# EAGLE design Display70_Cape (EAGLE 7.7.0)
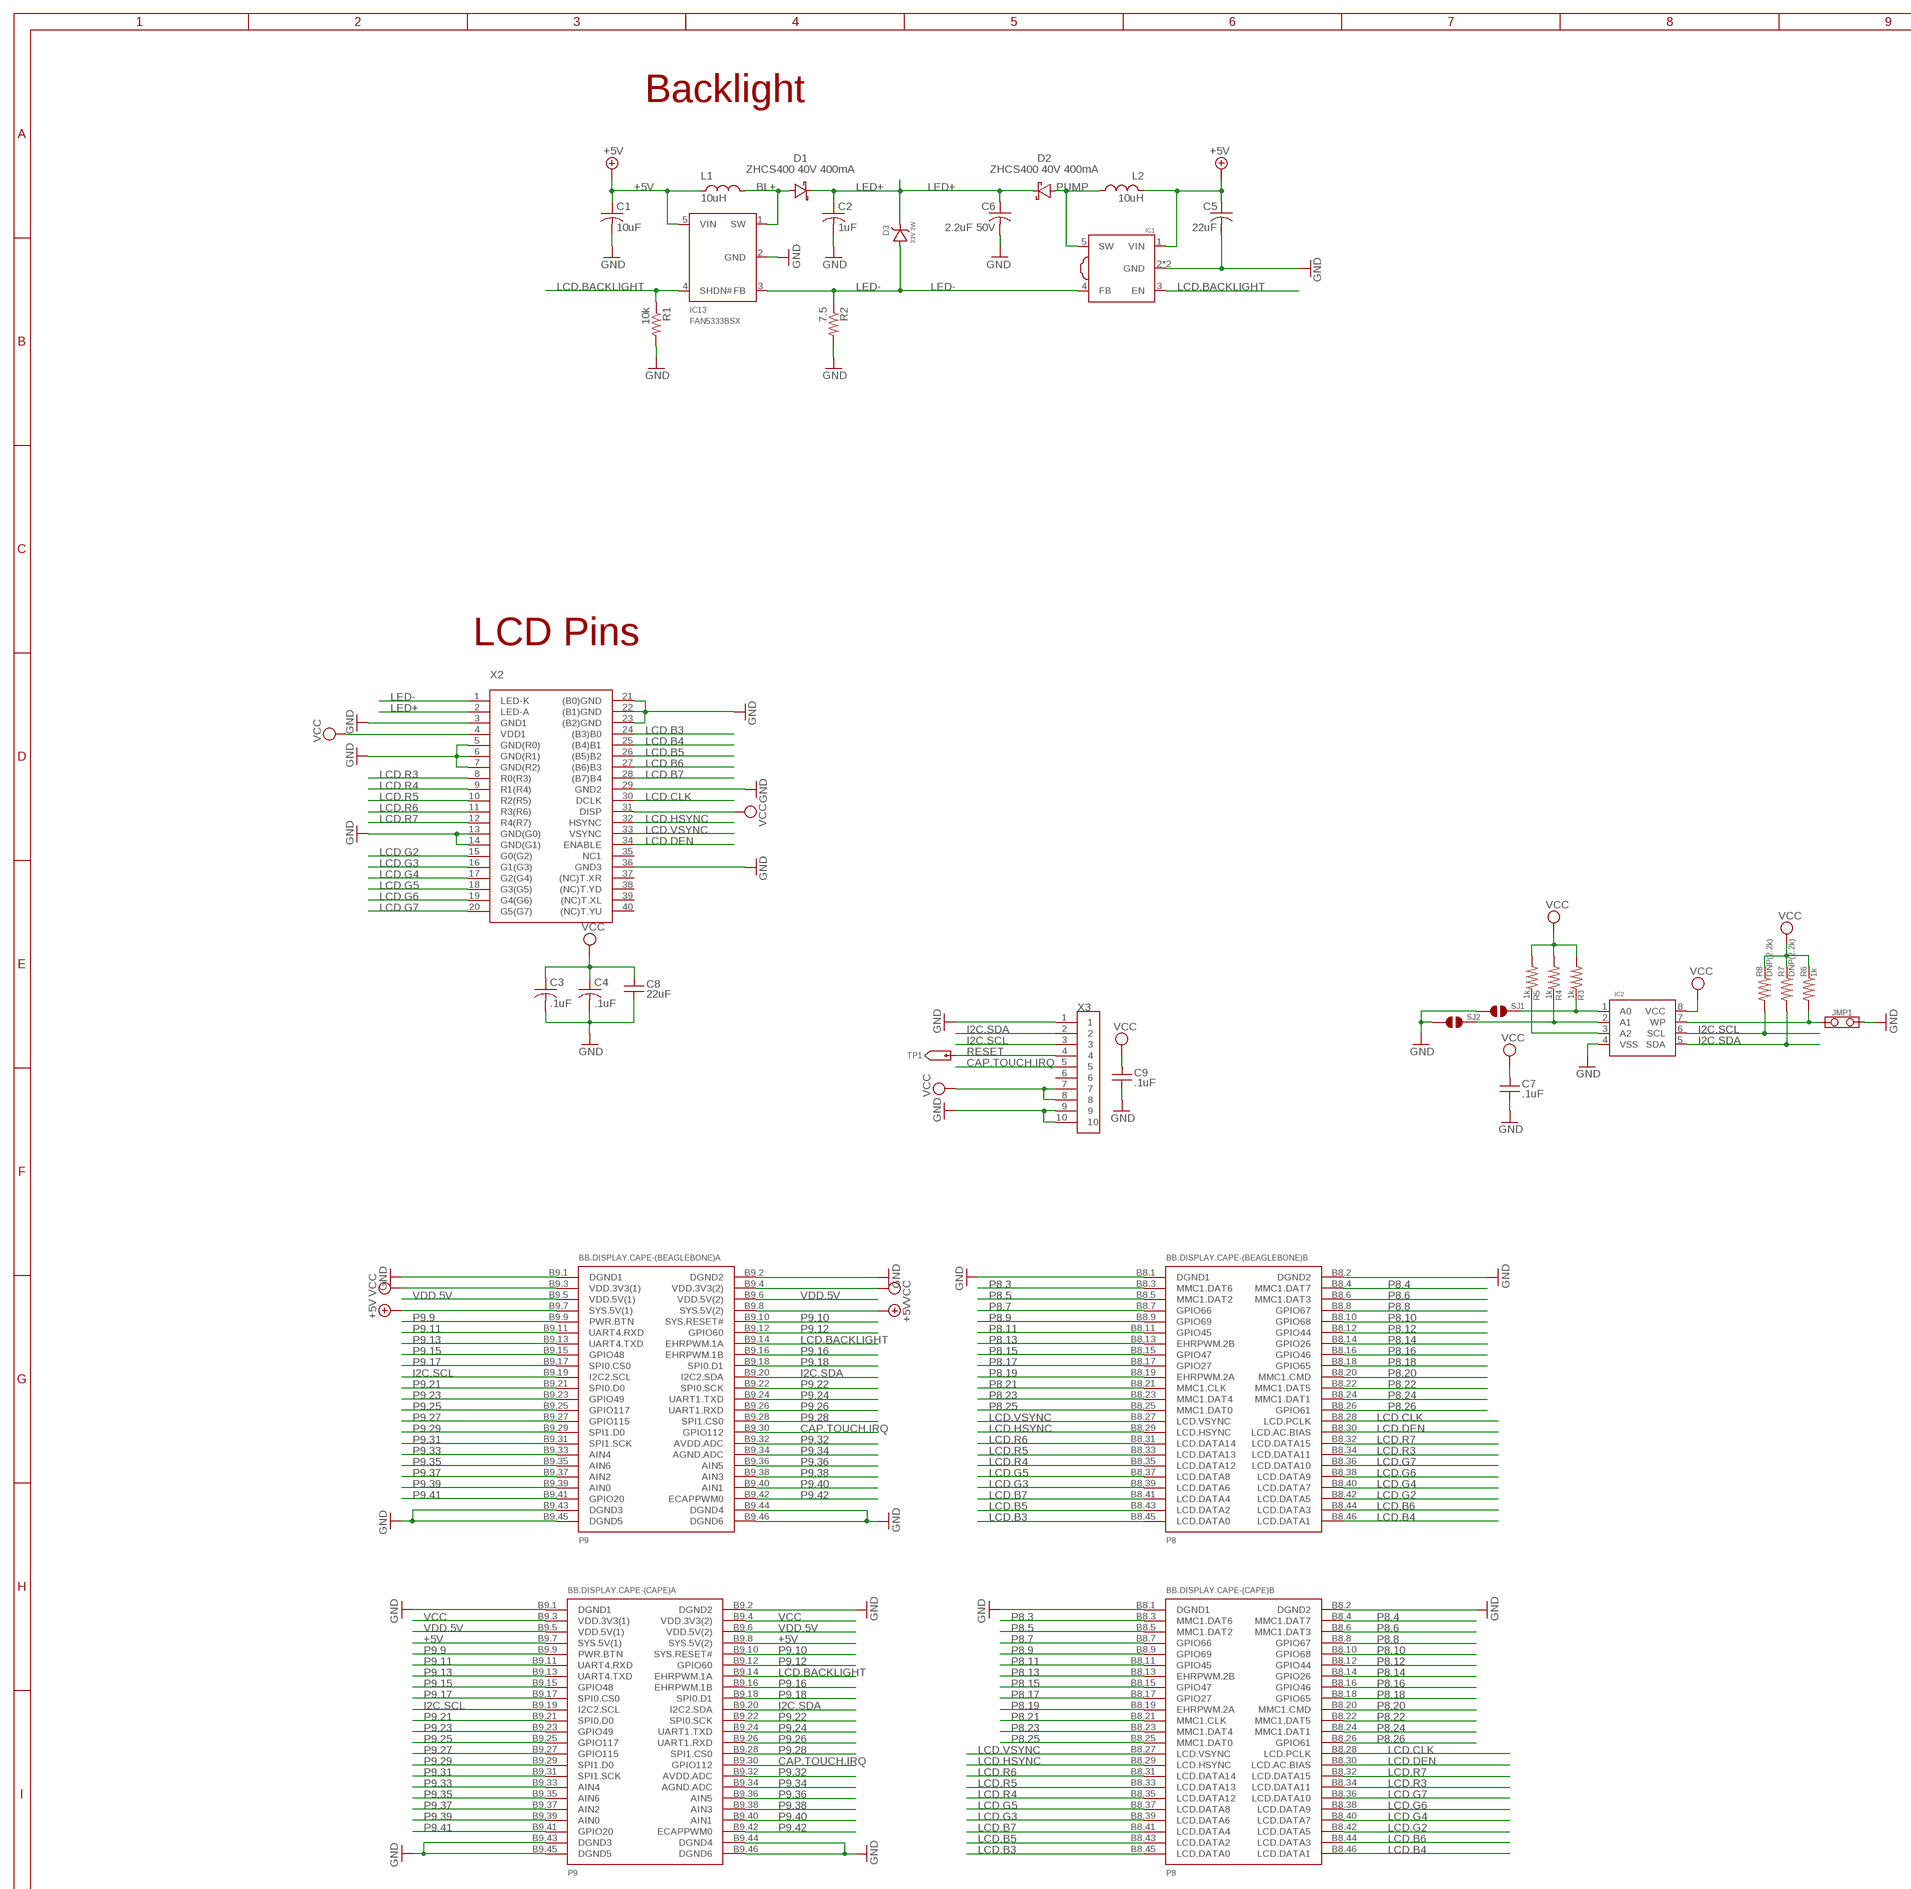
[diagram p0: schematic, sheet 1, part 1 of 2]
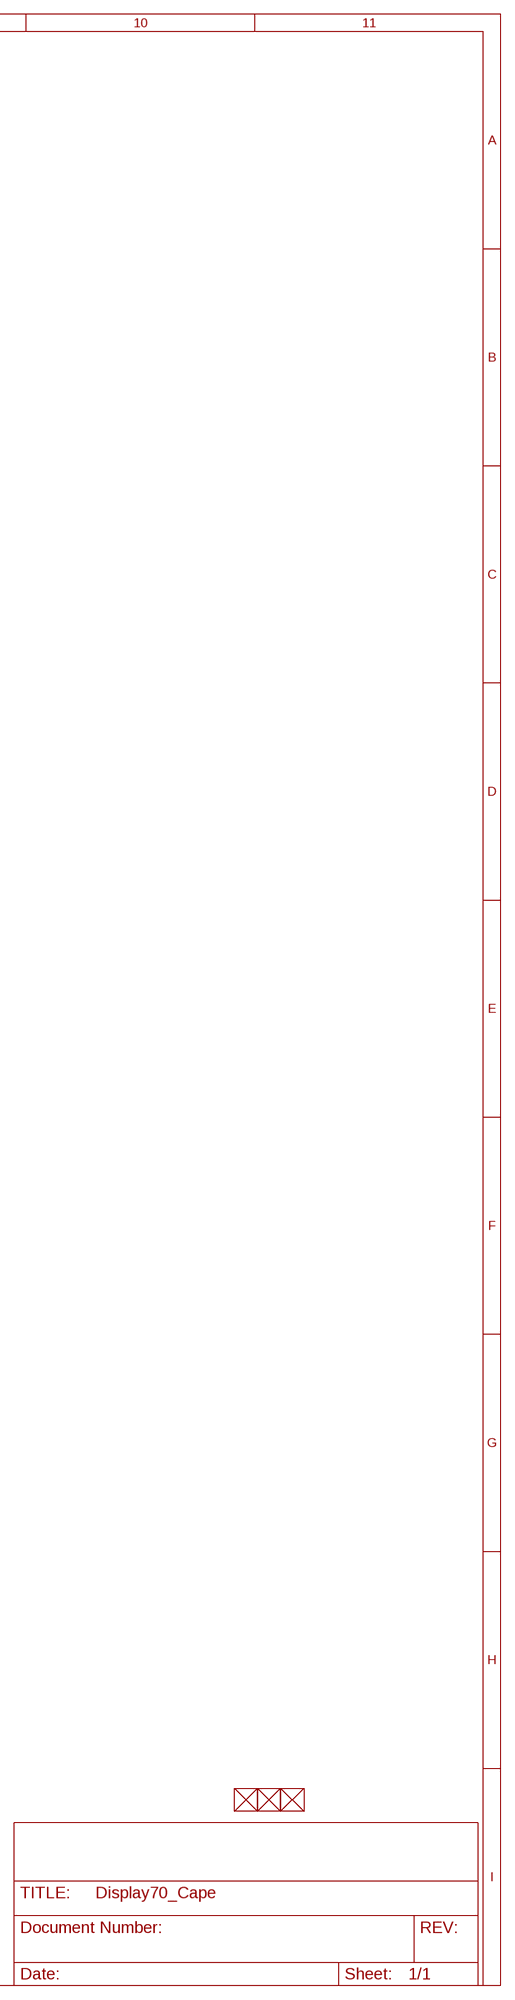
[diagram p1: schematic, sheet 1, part 2 of 2]

## Parts
BB.DISPLAY.CAPE-(BEAGLEBONE)  BEAGLEBONE.CAPE.DISPLAY-7.BEAGLEBONE  [BEAGLEBONE.CAPE.DISPLAY-7.BEAGLEBONE]
BB.DISPLAY.CAPE-(CAPE)  BEAGLEBONE.CAPE.DISPLAY-7.CAPE  [BEAGLEBONE.CAPE.DISPLAY-7.CAPE]
C1  10uF  C-USC0603K  [C0603K]
C2  1uF  C-USC0805K  [C0805K]
C3  .1uF  C-USC0402K  [C0402K]
C4  .1uF  C-USC0402K  [C0402K]
C5  22uF  C-USC0603K  [C0603K]
C6  2.2uF 50V  C-USC0805K  [C0805K]
C7  .1uF  CAPACITOR-(INCH)-0402  [0402]
C8  22uF  CAPACITOR-(INCH)-0805  [0805]
C9  .1uF  CAPACITOR-(INCH)-0402  [0402]
D1  ZHCS400 40V 400mA  DIODE-SCHOTTKY-(NXP)-SOD323-(WAVE)  [SOD323(NXP)WAVE]
D2  ZHCS400 40V 400mA  DIODE-SCHOTTKY-(NXP)-SOD323-(WAVE)  [SOD323(NXP)WAVE]
D3  33V 3W  DIODE-ZENER-  [SMB(ON.SEMI)]
FUD1  FIDUCIAL  [FIDUCIAL_40MIL]
FUD2  FIDUCIAL  [FIDUCIAL_40MIL]
FUD3  FIDUCIAL  [FIDUCIAL_40MIL]
IC1  PT4110  [SOT89-5(DIODES)]
IC2  CAT24C32  [UDFN8,2X3(ON-SEMI)]
IC13  FAN5333BSX  FAN533X  [SOT23-5(FAIRCHILD)]
JMP1  JUMPER-(X2)  [JUMPER-(X2)]
L1  10uH  INDUCTOR-(TAIYO-YUDEN)-NRS5030  [NRS(TAIYO.YUDEN)]
L2  10uH  INDUCTOR-(TAIYO-YUDEN)-NRS5030  [NRS(TAIYO.YUDEN)]
R1  10k  R-US_R0603  [R0603]
R2  7.5  R-US_R0603  [R0603]
R3  1k  RESISTOR-(INCH)-0402  [0402]
R4  1k  RESISTOR-(INCH)-0402  [0402]
R5  1k  RESISTOR-(INCH)-0402  [0402]
R6  1k  RESISTOR-(INCH)-0402  [0402]
R7  DNP(2.2k)  RESISTOR-(INCH)-0402  [0402]
R8  DNP(2.2k)  RESISTOR-(INCH)-0402  [0402]
SJ1  SOLDER.JOINT-(INCH)-0402  [SOLDER.JOINT(0402)]
SJ2  SOLDER.JOINT-(INCH)-0402  [SOLDER.JOINT(0402)]
TP1  TESTPAD/W_HOLE_1X1  [TESTPAD/W_HOLE_1X1]
X2  LCD-40PIN_FFC/FPC_0.5MM_PITCH  [KISD04-40_T1_E]
X3  10-PIN-(0.5MM-PITCH)-FPC-CONNECTOR  [10-PIN-(0.5MM-PITCH)-FPC-CONNECTOR]

## Nets
+5V [power]: BB.DISPLAY.CAPE-(BEAGLEBONE).B9.7(A:SYS.5V(1)) BB.DISPLAY.CAPE-(BEAGLEBONE).B9.8(A:SYS.5V(2)) BB.DISPLAY.CAPE-(CAPE).B9.7(A:SYS.5V(1)) BB.DISPLAY.CAPE-(CAPE).B9.8(A:SYS.5V(2)) C1.1 C5.1 IC1.1(VIN) IC13.5(VIN) L1.1 L2.1
A0: IC2.1(A0) R3.2 SJ1.2
A1: IC2.2(A1) R4.2 SJ2.2
A2: IC2.3(A2) R5.2
BL+: D1.A(ANODE) IC13.1(SW) L1.2
CAP.TOUCH.IRQ: BB.DISPLAY.CAPE-(BEAGLEBONE).B9.30(A:GPIO112) BB.DISPLAY.CAPE-(CAPE).B9.30(A:GPIO112) X3.5
GND [power]: BB.DISPLAY.CAPE-(BEAGLEBONE).B8.1(B:DGND1) BB.DISPLAY.CAPE-(BEAGLEBONE).B8.2(B:DGND2) BB.DISPLAY.CAPE-(BEAGLEBONE).B9.1(A:DGND1) BB.DISPLAY.CAPE-(BEAGLEBONE).B9.2(A:DGND2) BB.DISPLAY.CAPE-(BEAGLEBONE).B9.43(A:DGND3) BB.DISPLAY.CAPE-(BEAGLEBONE).B9.44(A:DGND4) BB.DISPLAY.CAPE-(BEAGLEBONE).B9.45(A:DGND5) BB.DISPLAY.CAPE-(BEAGLEBONE).B9.46(A:DGND6) BB.DISPLAY.CAPE-(CAPE).B8.1(B:DGND1) BB.DISPLAY.CAPE-(CAPE).B8.2(B:DGND2) BB.DISPLAY.CAPE-(CAPE).B9.1(A:DGND1) BB.DISPLAY.CAPE-(CAPE).B9.2(A:DGND2) BB.DISPLAY.CAPE-(CAPE).B9.43(A:DGND3) BB.DISPLAY.CAPE-(CAPE).B9.44(A:DGND4) BB.DISPLAY.CAPE-(CAPE).B9.45(A:DGND5) BB.DISPLAY.CAPE-(CAPE).B9.46(A:DGND6) C1.2 C2.2 C3.2 C4.2 C5.2 C6.2 C7.2 C8.2 C9.2 IC1.2(GND) IC1.THERMAL(GND) IC2.4(VSS) IC13.2(GND) JMP1.2 R1.2 R2.2 SJ1.1 SJ2.1 X2.3(GND1) X2.5(GND(R0)) X2.6(GND(R1)) X2.7(GND(R2)) X2.13(GND(G0)) X2.14(GND(G1)) X2.21((B0)GND) X2.22((B1)GND) X2.23((B2)GND) X2.29(GND2) X2.36(GND3) X3.1 X3.9 X3.10
I2C.SCL: BB.DISPLAY.CAPE-(BEAGLEBONE).B9.19(A:I2C2.SCL) BB.DISPLAY.CAPE-(CAPE).B9.19(A:I2C2.SCL) IC2.6(SCL) R8.1 X3.3
I2C.SDA: BB.DISPLAY.CAPE-(BEAGLEBONE).B9.20(A:I2C2.SDA) BB.DISPLAY.CAPE-(CAPE).B9.20(A:I2C2.SDA) IC2.5(SDA) R7.1 X3.2
LCD.B3: BB.DISPLAY.CAPE-(BEAGLEBONE).B8.45(B:LCD.DATA0) BB.DISPLAY.CAPE-(CAPE).B8.45(B:LCD.DATA0) X2.24((B3)B0)
LCD.B4: BB.DISPLAY.CAPE-(BEAGLEBONE).B8.46(B:LCD.DATA1) BB.DISPLAY.CAPE-(CAPE).B8.46(B:LCD.DATA1) X2.25((B4)B1)
LCD.B5: BB.DISPLAY.CAPE-(BEAGLEBONE).B8.43(B:LCD.DATA2) BB.DISPLAY.CAPE-(CAPE).B8.43(B:LCD.DATA2) X2.26((B5)B2)
LCD.B6: BB.DISPLAY.CAPE-(BEAGLEBONE).B8.44(B:LCD.DATA3) BB.DISPLAY.CAPE-(CAPE).B8.44(B:LCD.DATA3) X2.27((B6)B3)
LCD.B7: BB.DISPLAY.CAPE-(BEAGLEBONE).B8.41(B:LCD.DATA4) BB.DISPLAY.CAPE-(CAPE).B8.41(B:LCD.DATA4) X2.28((B7)B4)
LCD.BACKLIGHT: BB.DISPLAY.CAPE-(BEAGLEBONE).B9.14(A:EHRPWM.1A) BB.DISPLAY.CAPE-(CAPE).B9.14(A:EHRPWM.1A) IC1.3(EN) IC13.4(SHDN#) R1.1
LCD.CLK: BB.DISPLAY.CAPE-(BEAGLEBONE).B8.28(B:LCD.PCLK) BB.DISPLAY.CAPE-(CAPE).B8.28(B:LCD.PCLK) X2.30(DCLK)
LCD.DEN: BB.DISPLAY.CAPE-(BEAGLEBONE).B8.30(B:LCD.AC.BIAS) BB.DISPLAY.CAPE-(CAPE).B8.30(B:LCD.AC.BIAS) X2.34(ENABLE)
LCD.G2: BB.DISPLAY.CAPE-(BEAGLEBONE).B8.42(B:LCD.DATA5) BB.DISPLAY.CAPE-(CAPE).B8.42(B:LCD.DATA5) X2.15(G0(G2))
LCD.G3: BB.DISPLAY.CAPE-(BEAGLEBONE).B8.39(B:LCD.DATA6) BB.DISPLAY.CAPE-(CAPE).B8.39(B:LCD.DATA6) X2.16(G1(G3))
LCD.G4: BB.DISPLAY.CAPE-(BEAGLEBONE).B8.40(B:LCD.DATA7) BB.DISPLAY.CAPE-(CAPE).B8.40(B:LCD.DATA7) X2.17(G2(G4))
LCD.G5: BB.DISPLAY.CAPE-(BEAGLEBONE).B8.37(B:LCD.DATA8) BB.DISPLAY.CAPE-(CAPE).B8.37(B:LCD.DATA8) X2.18(G3(G5))
LCD.G6: BB.DISPLAY.CAPE-(BEAGLEBONE).B8.38(B:LCD.DATA9) BB.DISPLAY.CAPE-(CAPE).B8.38(B:LCD.DATA9) X2.19(G4(G6))
LCD.G7: BB.DISPLAY.CAPE-(BEAGLEBONE).B8.36(B:LCD.DATA10) BB.DISPLAY.CAPE-(CAPE).B8.36(B:LCD.DATA10) X2.20(G5(G7))
LCD.HSYNC: BB.DISPLAY.CAPE-(BEAGLEBONE).B8.29(B:LCD.HSYNC) BB.DISPLAY.CAPE-(CAPE).B8.29(B:LCD.HSYNC) X2.32(HSYNC)
LCD.R3: BB.DISPLAY.CAPE-(BEAGLEBONE).B8.34(B:LCD.DATA11) BB.DISPLAY.CAPE-(CAPE).B8.34(B:LCD.DATA11) X2.8(R0(R3))
LCD.R4: BB.DISPLAY.CAPE-(BEAGLEBONE).B8.35(B:LCD.DATA12) BB.DISPLAY.CAPE-(CAPE).B8.35(B:LCD.DATA12) X2.9(R1(R4))
LCD.R5: BB.DISPLAY.CAPE-(BEAGLEBONE).B8.33(B:LCD.DATA13) BB.DISPLAY.CAPE-(CAPE).B8.33(B:LCD.DATA13) X2.10(R2(R5))
LCD.R6: BB.DISPLAY.CAPE-(BEAGLEBONE).B8.31(B:LCD.DATA14) BB.DISPLAY.CAPE-(CAPE).B8.31(B:LCD.DATA14) X2.11(R3(R6))
LCD.R7: BB.DISPLAY.CAPE-(BEAGLEBONE).B8.32(B:LCD.DATA15) BB.DISPLAY.CAPE-(CAPE).B8.32(B:LCD.DATA15) X2.12(R4(R7))
LCD.VSYNC: BB.DISPLAY.CAPE-(BEAGLEBONE).B8.27(B:LCD.VSYNC) BB.DISPLAY.CAPE-(CAPE).B8.27(B:LCD.VSYNC) X2.33(VSYNC)
LED+: C2.1 C6.1 D1.C(CATHODE) D2.C(CATHODE) D3.K X2.2(LED-A)
LED-: D3.A IC1.4(FB) IC13.3(FB) R2.1 X2.1(LED-K)
P8.3: BB.DISPLAY.CAPE-(BEAGLEBONE).B8.3(B:MMC1.DAT6) BB.DISPLAY.CAPE-(CAPE).B8.3(B:MMC1.DAT6)
P8.4: BB.DISPLAY.CAPE-(BEAGLEBONE).B8.4(B:MMC1.DAT7) BB.DISPLAY.CAPE-(CAPE).B8.4(B:MMC1.DAT7)
P8.5: BB.DISPLAY.CAPE-(BEAGLEBONE).B8.5(B:MMC1.DAT2) BB.DISPLAY.CAPE-(CAPE).B8.5(B:MMC1.DAT2)
P8.6: BB.DISPLAY.CAPE-(BEAGLEBONE).B8.6(B:MMC1.DAT3) BB.DISPLAY.CAPE-(CAPE).B8.6(B:MMC1.DAT3)
P8.7: BB.DISPLAY.CAPE-(BEAGLEBONE).B8.7(B:GPIO66) BB.DISPLAY.CAPE-(CAPE).B8.7(B:GPIO66)
P8.8: BB.DISPLAY.CAPE-(BEAGLEBONE).B8.8(B:GPIO67) BB.DISPLAY.CAPE-(CAPE).B8.8(B:GPIO67)
P8.9: BB.DISPLAY.CAPE-(BEAGLEBONE).B8.9(B:GPIO69) BB.DISPLAY.CAPE-(CAPE).B8.9(B:GPIO69)
P8.10: BB.DISPLAY.CAPE-(BEAGLEBONE).B8.10(B:GPIO68) BB.DISPLAY.CAPE-(CAPE).B8.10(B:GPIO68)
P8.11: BB.DISPLAY.CAPE-(BEAGLEBONE).B8.11(B:GPIO45) BB.DISPLAY.CAPE-(CAPE).B8.11(B:GPIO45)
P8.12: BB.DISPLAY.CAPE-(BEAGLEBONE).B8.12(B:GPIO44) BB.DISPLAY.CAPE-(CAPE).B8.12(B:GPIO44)
P8.13: BB.DISPLAY.CAPE-(BEAGLEBONE).B8.13(B:EHRPWM.2B) BB.DISPLAY.CAPE-(CAPE).B8.13(B:EHRPWM.2B)
P8.14: BB.DISPLAY.CAPE-(BEAGLEBONE).B8.14(B:GPIO26) BB.DISPLAY.CAPE-(CAPE).B8.14(B:GPIO26)
P8.15: BB.DISPLAY.CAPE-(BEAGLEBONE).B8.15(B:GPIO47) BB.DISPLAY.CAPE-(CAPE).B8.15(B:GPIO47)
P8.16: BB.DISPLAY.CAPE-(BEAGLEBONE).B8.16(B:GPIO46) BB.DISPLAY.CAPE-(CAPE).B8.16(B:GPIO46)
P8.17: BB.DISPLAY.CAPE-(BEAGLEBONE).B8.17(B:GPIO27) BB.DISPLAY.CAPE-(CAPE).B8.17(B:GPIO27)
P8.18: BB.DISPLAY.CAPE-(BEAGLEBONE).B8.18(B:GPIO65) BB.DISPLAY.CAPE-(CAPE).B8.18(B:GPIO65)
P8.19: BB.DISPLAY.CAPE-(BEAGLEBONE).B8.19(B:EHRPWM.2A) BB.DISPLAY.CAPE-(CAPE).B8.19(B:EHRPWM.2A)
P8.20: BB.DISPLAY.CAPE-(BEAGLEBONE).B8.20(B:MMC1.CMD) BB.DISPLAY.CAPE-(CAPE).B8.20(B:MMC1.CMD)
P8.21: BB.DISPLAY.CAPE-(BEAGLEBONE).B8.21(B:MMC1.CLK) BB.DISPLAY.CAPE-(CAPE).B8.21(B:MMC1.CLK)
P8.22: BB.DISPLAY.CAPE-(BEAGLEBONE).B8.22(B:MMC1.DAT5) BB.DISPLAY.CAPE-(CAPE).B8.22(B:MMC1.DAT5)
P8.23: BB.DISPLAY.CAPE-(BEAGLEBONE).B8.23(B:MMC1.DAT4) BB.DISPLAY.CAPE-(CAPE).B8.23(B:MMC1.DAT4)
P8.24: BB.DISPLAY.CAPE-(BEAGLEBONE).B8.24(B:MMC1.DAT1) BB.DISPLAY.CAPE-(CAPE).B8.24(B:MMC1.DAT1)
P8.25: BB.DISPLAY.CAPE-(BEAGLEBONE).B8.25(B:MMC1.DAT0) BB.DISPLAY.CAPE-(CAPE).B8.25(B:MMC1.DAT0)
P8.26: BB.DISPLAY.CAPE-(BEAGLEBONE).B8.26(B:GPIO61) BB.DISPLAY.CAPE-(CAPE).B8.26(B:GPIO61)
P9.9: BB.DISPLAY.CAPE-(BEAGLEBONE).B9.9(A:PWR.BTN) BB.DISPLAY.CAPE-(CAPE).B9.9(A:PWR.BTN)
P9.10: BB.DISPLAY.CAPE-(BEAGLEBONE).B9.10(A:SYS.RESET#) BB.DISPLAY.CAPE-(CAPE).B9.10(A:SYS.RESET#)
P9.11: BB.DISPLAY.CAPE-(BEAGLEBONE).B9.11(A:UART4.RXD) BB.DISPLAY.CAPE-(CAPE).B9.11(A:UART4.RXD)
P9.12: BB.DISPLAY.CAPE-(BEAGLEBONE).B9.12(A:GPIO60) BB.DISPLAY.CAPE-(CAPE).B9.12(A:GPIO60)
P9.13: BB.DISPLAY.CAPE-(BEAGLEBONE).B9.13(A:UART4.TXD) BB.DISPLAY.CAPE-(CAPE).B9.13(A:UART4.TXD)
P9.15: BB.DISPLAY.CAPE-(BEAGLEBONE).B9.15(A:GPIO48) BB.DISPLAY.CAPE-(CAPE).B9.15(A:GPIO48)
P9.16: BB.DISPLAY.CAPE-(BEAGLEBONE).B9.16(A:EHRPWM.1B) BB.DISPLAY.CAPE-(CAPE).B9.16(A:EHRPWM.1B)
P9.17: BB.DISPLAY.CAPE-(BEAGLEBONE).B9.17(A:SPI0.CS0) BB.DISPLAY.CAPE-(CAPE).B9.17(A:SPI0.CS0)
P9.18: BB.DISPLAY.CAPE-(BEAGLEBONE).B9.18(A:SPI0.D1) BB.DISPLAY.CAPE-(CAPE).B9.18(A:SPI0.D1)
P9.21: BB.DISPLAY.CAPE-(BEAGLEBONE).B9.21(A:SPI0.D0) BB.DISPLAY.CAPE-(CAPE).B9.21(A:SPI0.D0)
P9.22: BB.DISPLAY.CAPE-(BEAGLEBONE).B9.22(A:SPI0.SCK) BB.DISPLAY.CAPE-(CAPE).B9.22(A:SPI0.SCK)
P9.23: BB.DISPLAY.CAPE-(BEAGLEBONE).B9.23(A:GPIO49) BB.DISPLAY.CAPE-(CAPE).B9.23(A:GPIO49)
P9.24: BB.DISPLAY.CAPE-(BEAGLEBONE).B9.24(A:UART1.TXD) BB.DISPLAY.CAPE-(CAPE).B9.24(A:UART1.TXD)
P9.25: BB.DISPLAY.CAPE-(BEAGLEBONE).B9.25(A:GPIO117) BB.DISPLAY.CAPE-(CAPE).B9.25(A:GPIO117)
P9.26: BB.DISPLAY.CAPE-(BEAGLEBONE).B9.26(A:UART1.RXD) BB.DISPLAY.CAPE-(CAPE).B9.26(A:UART1.RXD)
P9.27: BB.DISPLAY.CAPE-(BEAGLEBONE).B9.27(A:GPIO115) BB.DISPLAY.CAPE-(CAPE).B9.27(A:GPIO115)
P9.28: BB.DISPLAY.CAPE-(BEAGLEBONE).B9.28(A:SPI1.CS0) BB.DISPLAY.CAPE-(CAPE).B9.28(A:SPI1.CS0)
P9.29: BB.DISPLAY.CAPE-(BEAGLEBONE).B9.29(A:SPI1.D0) BB.DISPLAY.CAPE-(CAPE).B9.29(A:SPI1.D0)
P9.31: BB.DISPLAY.CAPE-(BEAGLEBONE).B9.31(A:SPI1.SCK) BB.DISPLAY.CAPE-(CAPE).B9.31(A:SPI1.SCK)
P9.32: BB.DISPLAY.CAPE-(BEAGLEBONE).B9.32(A:AVDD.ADC) BB.DISPLAY.CAPE-(CAPE).B9.32(A:AVDD.ADC)
P9.33: BB.DISPLAY.CAPE-(BEAGLEBONE).B9.33(A:AIN4) BB.DISPLAY.CAPE-(CAPE).B9.33(A:AIN4)
P9.34: BB.DISPLAY.CAPE-(BEAGLEBONE).B9.34(A:AGND.ADC) BB.DISPLAY.CAPE-(CAPE).B9.34(A:AGND.ADC)
P9.35: BB.DISPLAY.CAPE-(BEAGLEBONE).B9.35(A:AIN6) BB.DISPLAY.CAPE-(CAPE).B9.35(A:AIN6)
P9.36: BB.DISPLAY.CAPE-(BEAGLEBONE).B9.36(A:AIN5) BB.DISPLAY.CAPE-(CAPE).B9.36(A:AIN5)
P9.37: BB.DISPLAY.CAPE-(BEAGLEBONE).B9.37(A:AIN2) BB.DISPLAY.CAPE-(CAPE).B9.37(A:AIN2)
P9.38: BB.DISPLAY.CAPE-(BEAGLEBONE).B9.38(A:AIN3) BB.DISPLAY.CAPE-(CAPE).B9.38(A:AIN3)
P9.39: BB.DISPLAY.CAPE-(BEAGLEBONE).B9.39(A:AIN0) BB.DISPLAY.CAPE-(CAPE).B9.39(A:AIN0)
P9.40: BB.DISPLAY.CAPE-(BEAGLEBONE).B9.40(A:AIN1) BB.DISPLAY.CAPE-(CAPE).B9.40(A:AIN1)
P9.41: BB.DISPLAY.CAPE-(BEAGLEBONE).B9.41(A:GPIO20) BB.DISPLAY.CAPE-(CAPE).B9.41(A:GPIO20)
P9.42: BB.DISPLAY.CAPE-(BEAGLEBONE).B9.42(A:ECAPPWM0) BB.DISPLAY.CAPE-(CAPE).B9.42(A:ECAPPWM0)
PUMP: D2.A(ANODE) IC1.5(SW) L2.2
RESET: TP1.P$1(TP) X3.4
VCC [power]: BB.DISPLAY.CAPE-(BEAGLEBONE).B9.3(A:VDD.3V3(1)) BB.DISPLAY.CAPE-(BEAGLEBONE).B9.4(A:VDD.3V3(2)) BB.DISPLAY.CAPE-(CAPE).B9.3(A:VDD.3V3(1)) BB.DISPLAY.CAPE-(CAPE).B9.4(A:VDD.3V3(2)) C3.1 C4.1 C7.1 C8.1 C9.1 IC2.8(VCC) R3.1 R4.1 R5.1 R6.2 R7.2 R8.2 X2.4(VDD1) X2.31(DISP) X3.7 X3.8
VDD.5V: BB.DISPLAY.CAPE-(BEAGLEBONE).B9.5(A:VDD.5V(1)) BB.DISPLAY.CAPE-(BEAGLEBONE).B9.6(A:VDD.5V(2)) BB.DISPLAY.CAPE-(CAPE).B9.5(A:VDD.5V(1)) BB.DISPLAY.CAPE-(CAPE).B9.6(A:VDD.5V(2))
WP: IC2.7(WP) JMP1.1 R6.1
Unconnected: FUD1.P$1 FUD2.P$1 FUD3.P$1 X2.35(NC1) X2.37((NC)T.XR) X2.38((NC)T.YD) X2.39((NC)T.XL) X2.40((NC)T.YU) X3.6

## Notes on the sheet
- Backlight
- LCD Pins

## Library data of the parts
BB.DISPLAY.CAPE-(BEAGLEBONE) BB.DISPLAY.CAPE-(CAPE) = GHI-Solutions:BEAGLEBONE.CAPE
C1-C6 = rcl:C-US: CAPACITOR, American symbol
C7-C9 = GHI-BasicComponents:CAPACITOR-(INCH)-: Basic SMD ceramic capacitors
D1 D2 = GHI-BasicComponents:DIODE-SCHOTTKY-(NXP)-
D3 = GHI-BasicComponents:DIODE-ZENER-
FUD1-FUD3 = GHI:FIDUCIAL
IC1 = GHI-IC:PT4110: High Efficiency White LED Driver
IC2 = GHI-IC:CAT24C32: 32-Kb I2C CMOS Serial EEPROM
IC13 = GHI-IC:FAN533X: High Efficiency, High Current Serial LED Driver with 30V Integrated Switch
JMP1 = GHI-Headers:JUMPER-(X2)
L1 L2 = GHI-BasicComponents:INDUCTOR-(TAIYO-YUDEN)-NRS
R1 R2 = rcl:R-US_: RESISTOR, American symbol
R3-R8 = GHI-BasicComponents:RESISTOR-(INCH)-: Basic SMD Resistors
SJ1 SJ2 = GHI-Miscellaneous:SOLDER.JOINT-(INCH)-: Solder Joint (Bridge) Pads - For easy solder joining.
TP1 = GHI2:TESTPAD/W_HOLE_1X1
X2 = GHI-VisualComponents:LCD-40PIN_FFC/FPC_0.5MM_PITCH
X3 = GHI-Connectors:10-PIN-(0.5MM-PITCH)-FPC-CONNECTOR

## Board
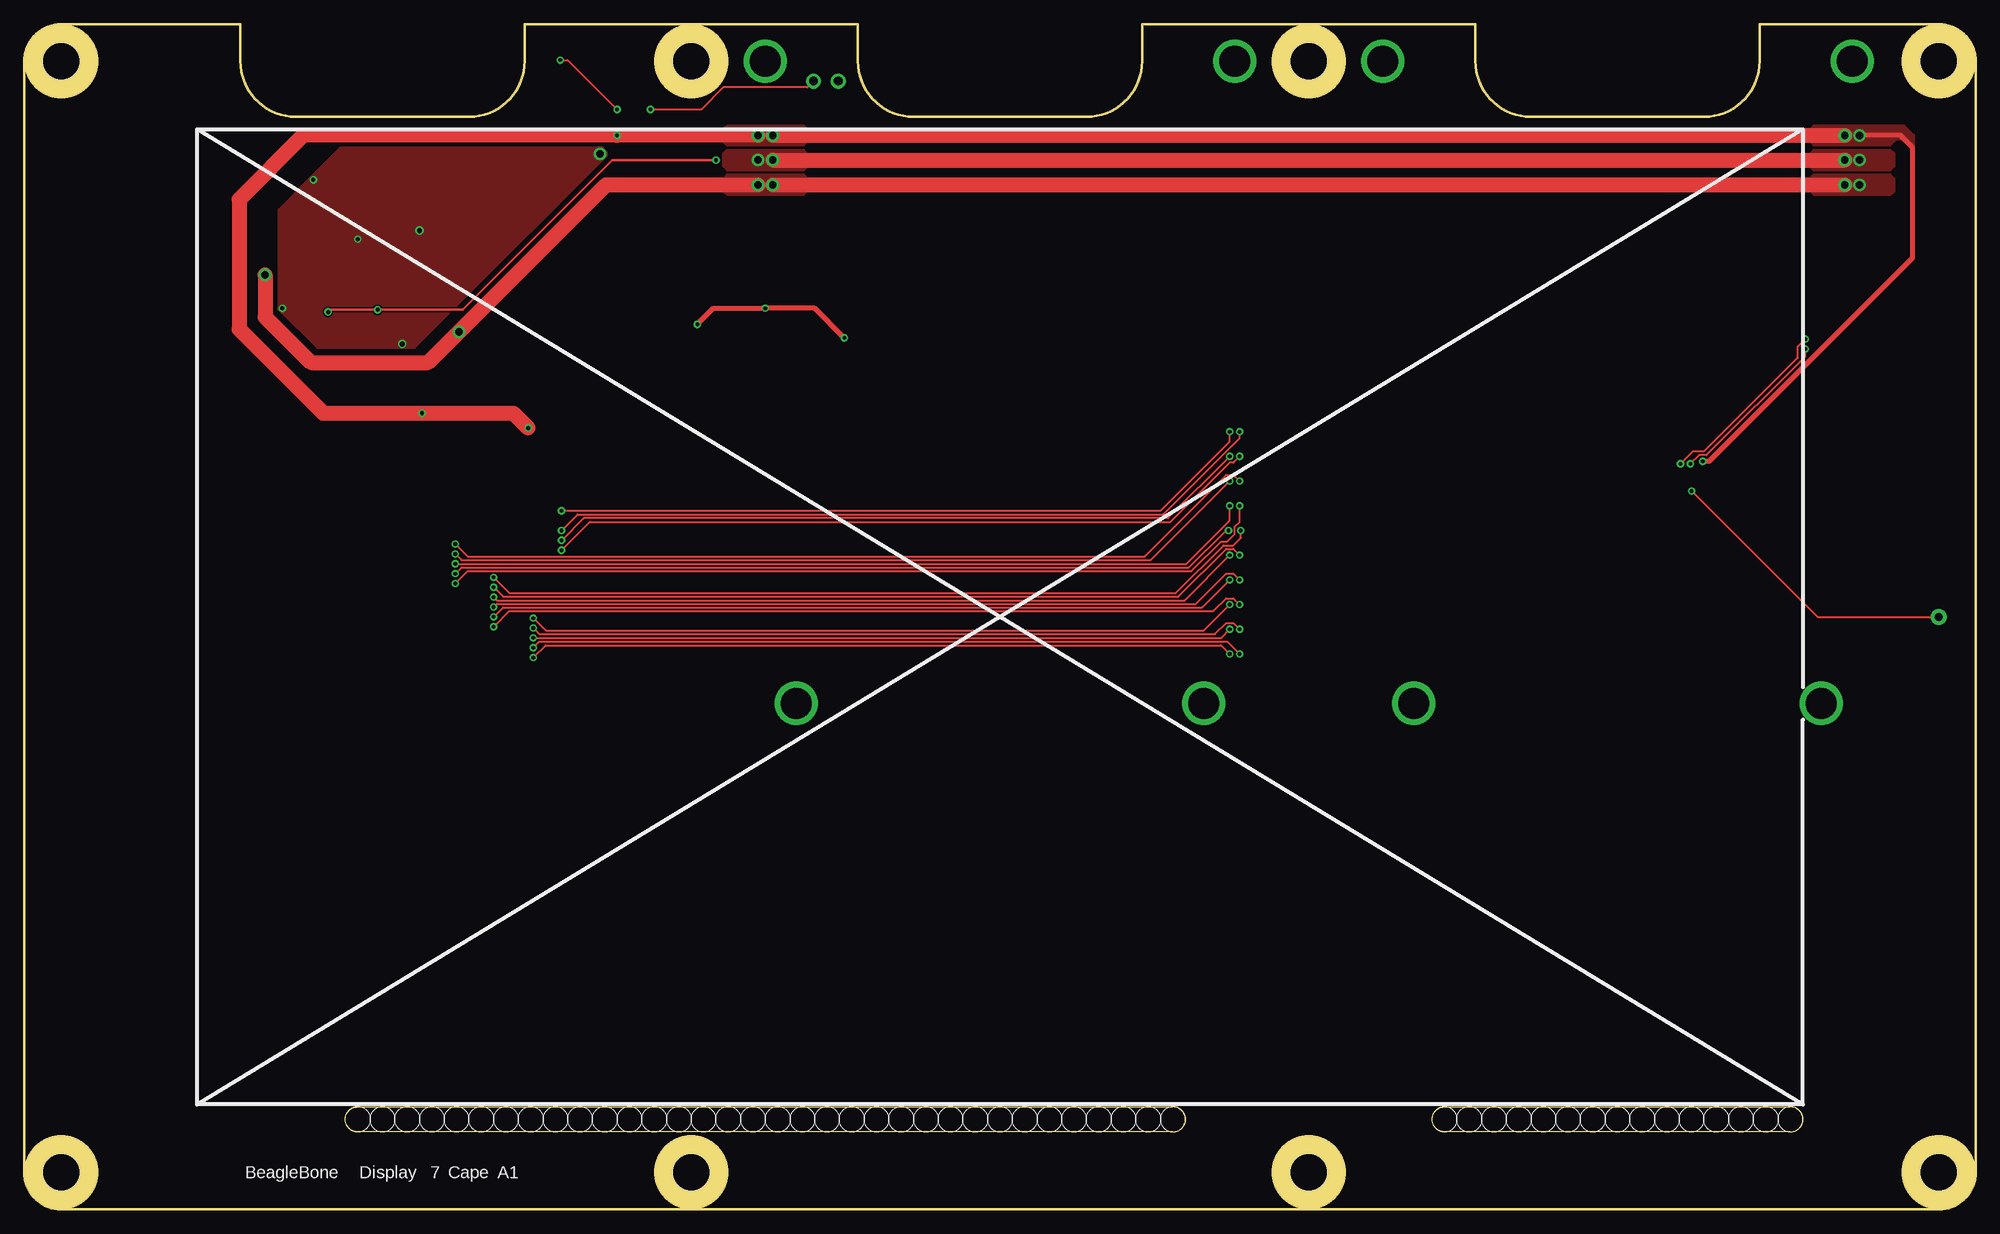
[diagram p2: board, top side]
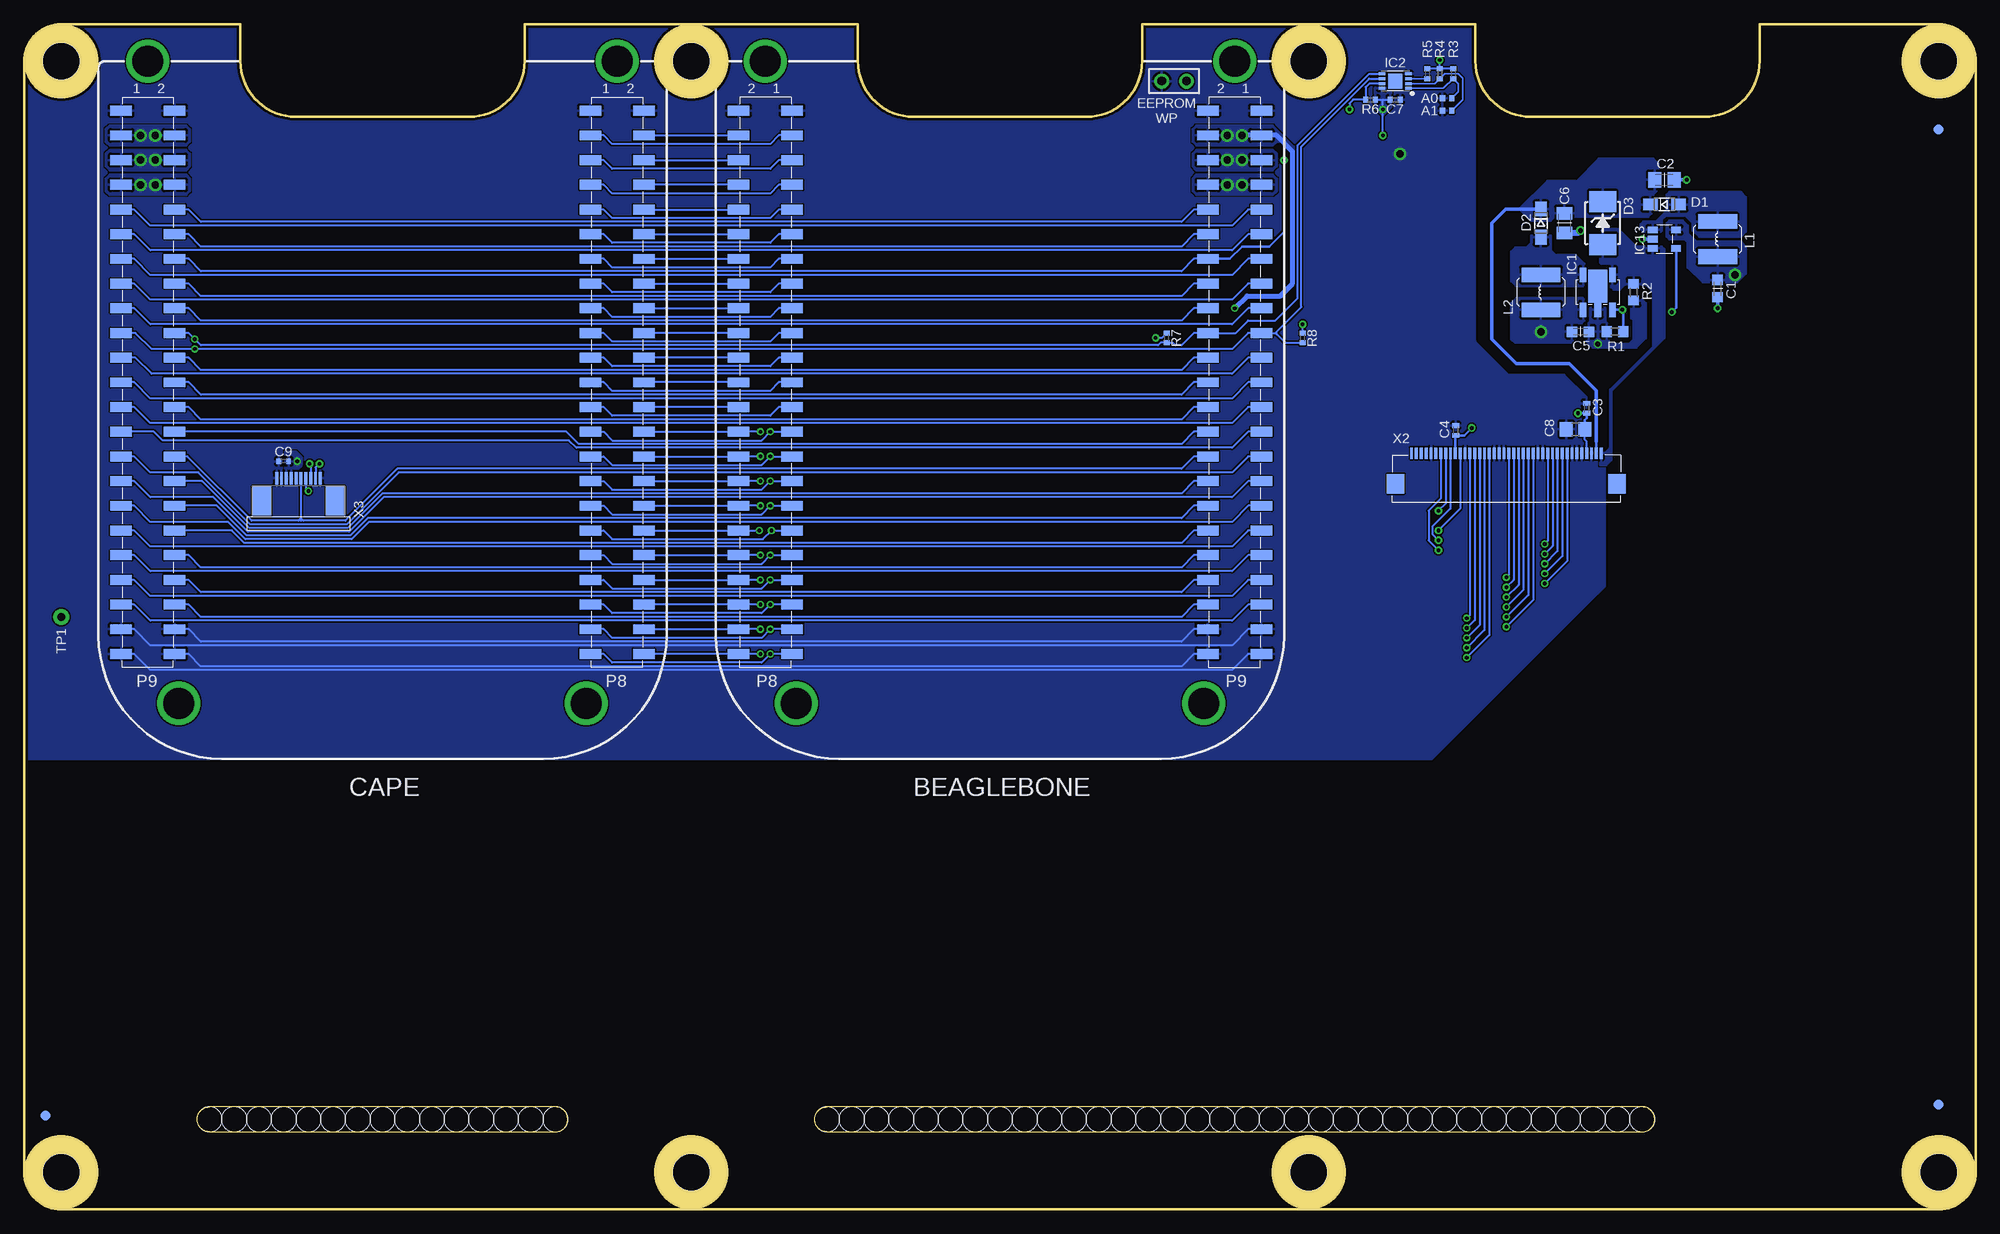
[diagram p3: board, bottom side, seen from below]

Size 200.66 x 121.92 mm. Coordinates in mm from the lower left corner, seen from the top.
Outline: 3.81,0 196.85,0 arc90 200.66,3.81 200.66,118.11 arc90 196.85,121.92 178.44,121.92 178.44,118.11 arc-90 172.72,112.39 154.94,112.39 arc-90 149.22,118.11 149.22,121.92 114.94,121.92 114.94,118.11 arc-90 109.22,112.39 91.44,112.39 arc-90 85.72,118.11 85.72,121.92 51.44,121.92 51.44,118.11 arc-90 45.72,112.39 27.94,112.39 arc-90 22.23,118.11 22.23,121.92 3.81,121.92 arc90 0,118.11 0,3.81 arc90 3.81,0
Outline: 34.29,10.54 118.11,10.54 arc-180 118.11,8 34.29,8 arc-180 34.29,10.54
Outline: 146.05,10.54 181.61,10.54 arc-180 181.61,8 146.05,8 arc-180 146.05,10.54
Outline: circle at 132.08,3.81 radius 2.86
Outline: circle at 132.08,118.11 radius 2.86
Outline: circle at 196.85,3.81 radius 2.86
Outline: circle at 196.85,118.11 radius 2.86
Outline: circle at 3.81,118.11 radius 2.86
Outline: circle at 3.81,3.81 radius 2.86
Outline: circle at 68.58,3.81 radius 2.86
Outline: circle at 68.58,118.11 radius 2.86
Copper layers (1+16): Top 0.035mm / dielectric 1.5mm / Bottom 0.035mm
Design rules "default *": minimum track width 6mil, minimum drill 12mil, track to track 6mil, track to pad 6mil, pad to pad 6mil, via to via 6mil, smd to smd 6mil, copper to edge 10mil, drill to drill 8mil, minimum pad ring 10mil, minimum via ring 7mil, stop-mask expansion 4mil, vias tented up to drill 35mil, thermal gap 10mil
Holes 3.81 mm at 132.08,118.11 132.08,3.81 3.81,118.11 196.85,118.11 196.85,3.81 3.81,3.81 68.58,118.11 68.58,3.81
Holes 2.54 mm at 118.11,9.27 34.29,9.27 36.83,9.27 39.37,9.27 41.91,9.27 44.45,9.27 46.99,9.27 49.53,9.27 52.07,9.27 54.61,9.27 57.15,9.27 59.69,9.27 62.23,9.27 64.77,9.27 67.31,9.27 69.85,9.27 72.39,9.27 74.93,9.27 77.47,9.27 80.01,9.27 82.55,9.27 85.09,9.27 87.63,9.27 90.17,9.27 92.71,9.27 95.25,9.27 97.79,9.27 100.33,9.27 102.87,9.27 105.41,9.27 107.95,9.27 110.49,9.27 113.03,9.27 115.57,9.27 146.05,9.27 148.59,9.27 151.13,9.27 153.67,9.27 156.21,9.27 158.75,9.27 161.29,9.27 163.83,9.27 166.37,9.27 168.91,9.27 171.45,9.27 173.99,9.27 176.53,9.27 179.07,9.27 181.61,9.27
bRestrict: area 174.4,75.1 to 174.5,75.3; area 40.7,77.7 to 40.8,77.9; area 41.2,77.7 to 41.3,77.9; area 44.7,77.7 to 44.8,77.9; area 48.7,77.7 to 48.8,77.9; area 49.2,77.7 to 49.3,77.9
Milling: 34 lines

### Footprints (pad centres in the part's own frame; a part is rotated, then mirrored left to right if it is on the bottom)
BEAGLEBONE.CAPE.DISPLAY-7.BEAGLEBONE = smd 1.02 x 2.2 bottom: B8.1 5.08,21.38; B8.2 5.08,26.88; B8.3 7.62,21.38; B8.4 7.62,26.88; B8.5 10.16,21.38; B8.6 10.16,26.88; B8.7 12.7,21.38; B8.8 12.7,26.88; B8.9 15.24,21.38; B8.10 15.24,26.88; B8.11 17.78,21.38; B8.12 17.78,26.88; B8.13 20.32,21.38; B8.14 20.32,26.88; B8.15 22.86,21.38; B8.16 22.86,26.88; B8.17 25.4,21.38; B8.18 25.4,26.88; B8.19 27.94,21.38; B8.20 27.94,26.88; B8.21 30.48,21.38; B8.22 30.48,26.88; B8.23 33.02,21.38; B8.24 33.02,26.88; B8.25 35.56,21.38; B8.26 35.56,26.88; B8.27 38.1,21.38; B8.28 38.1,26.88; B8.29 40.64,21.38; B8.30 40.64,26.88; B8.31 43.18,21.38; B8.32 43.18,26.88; B8.33 45.72,21.38; B8.34 45.72,26.88; B8.35 48.26,21.38; B8.36 48.26,26.88; B8.37 50.8,21.38; B8.38 50.8,26.88; B8.39 53.34,21.38; B8.40 53.34,26.88; B8.41 55.88,21.38; B8.42 55.88,26.88; B8.43 58.42,21.38; B8.44 58.42,26.88; B8.45 60.96,21.38; B8.46 60.96,26.88; B9.1 5.08,-26.88; B9.2 5.08,-21.38; B9.3 7.62,-26.88; B9.4 7.62,-21.38; B9.5 10.16,-26.88; B9.6 10.16,-21.38; B9.7 12.7,-26.88; B9.8 12.7,-21.38; B9.9 15.24,-26.88; B9.10 15.24,-21.38; B9.11 17.78,-26.88; B9.12 17.78,-21.38; B9.13 20.32,-26.88; B9.14 20.32,-21.38; B9.15 22.86,-26.88; B9.16 22.86,-21.38; B9.17 25.4,-26.88; B9.18 25.4,-21.38; B9.19 27.94,-26.88; B9.20 27.94,-21.38; B9.21 30.48,-26.88; B9.22 30.48,-21.38; B9.23 33.02,-26.88; B9.24 33.02,-21.38; B9.25 35.56,-26.88; B9.26 35.56,-21.38; B9.27 38.1,-26.88; B9.28 38.1,-21.38; B9.29 40.64,-26.88; B9.30 40.64,-21.38; B9.31 43.18,-26.88; B9.32 43.18,-21.38; B9.33 45.72,-26.88; B9.34 45.72,-21.38; B9.35 48.26,-26.88; B9.36 48.26,-21.38; B9.37 50.8,-26.88; B9.38 50.8,-21.38; B9.39 53.34,-26.88; B9.40 53.34,-21.38; B9.41 55.88,-26.88; B9.42 55.88,-21.38; B9.43 58.42,-26.88; B9.44 58.42,-21.38; B9.45 60.96,-26.88; B9.46 60.96,-21.38 | drill 3.175 pad 4.445: MH.1 0,-24.13; MH.2 66.04,-20.955; MH.3 66.04,20.955; MH.4 0,24.13
BEAGLEBONE.CAPE.DISPLAY-7.CAPE = smd 1.02 x 2.2 bottom: B8.1 5.08,-21.38; B8.2 5.08,-26.88; B8.3 7.62,-21.38; B8.4 7.62,-26.88; B8.5 10.16,-21.38; B8.6 10.16,-26.88; B8.7 12.7,-21.38; B8.8 12.7,-26.88; B8.9 15.24,-21.38; B8.10 15.24,-26.88; B8.11 17.78,-21.38; B8.12 17.78,-26.88; B8.13 20.32,-21.38; B8.14 20.32,-26.88; B8.15 22.86,-21.38; B8.16 22.86,-26.88; B8.17 25.4,-21.38; B8.18 25.4,-26.88; B8.19 27.94,-21.38; B8.20 27.94,-26.88; B8.21 30.48,-21.38; B8.22 30.48,-26.88; B8.23 33.02,-21.38; B8.24 33.02,-26.88; B8.25 35.56,-21.38; B8.26 35.56,-26.88; B8.27 38.1,-21.38; B8.28 38.1,-26.88; B8.29 40.64,-21.38; B8.30 40.64,-26.88; B8.31 43.18,-21.38; B8.32 43.18,-26.88; B8.33 45.72,-21.38; B8.34 45.72,-26.88; B8.35 48.26,-21.38; B8.36 48.26,-26.88; B8.37 50.8,-21.38; B8.38 50.8,-26.88; B8.39 53.34,-21.38; B8.40 53.34,-26.88; B8.41 55.88,-21.38; B8.42 55.88,-26.88; B8.43 58.42,-21.38; B8.44 58.42,-26.88; B8.45 60.96,-21.38; B8.46 60.96,-26.88; B9.1 5.08,26.88; B9.2 5.08,21.38; B9.3 7.62,26.88; B9.4 7.62,21.38; B9.5 10.16,26.88; B9.6 10.16,21.38; B9.7 12.7,26.88; B9.8 12.7,21.38; B9.9 15.24,26.88; B9.10 15.24,21.38; B9.11 17.78,26.88; B9.12 17.78,21.38; B9.13 20.32,26.88; B9.14 20.32,21.38; B9.15 22.86,26.88; B9.16 22.86,21.38; B9.17 25.4,26.88; B9.18 25.4,21.38; B9.19 27.94,26.88; B9.20 27.94,21.38; B9.21 30.48,26.88; B9.22 30.48,21.38; B9.23 33.02,26.88; B9.24 33.02,21.38; B9.25 35.56,26.88; B9.26 35.56,21.38; B9.27 38.1,26.88; B9.28 38.1,21.38; B9.29 40.64,26.88; B9.30 40.64,21.38; B9.31 43.18,26.88; B9.32 43.18,21.38; B9.33 45.72,26.88; B9.34 45.72,21.38; B9.35 48.26,26.88; B9.36 48.26,21.38; B9.37 50.8,26.88; B9.38 50.8,21.38; B9.39 53.34,26.88; B9.40 53.34,21.38; B9.41 55.88,26.88; B9.42 55.88,21.38; B9.43 58.42,26.88; B9.44 58.42,21.38; B9.45 60.96,26.88; B9.46 60.96,21.38 | drill 3.175 pad 4.445: MH.1 0,-24.13; MH.2 66.04,-20.955; MH.3 66.04,20.955; MH.4 0,24.13
C0603K = smd 1.05 x 1.08: 1 -0.875,0; 2 0.875,0
C0805K = smd 1.3 x 1.6: 1 -1,0; 2 1,0
C0402K = smd 0.5 x 0.7: 1 -0.5,0; 2 0.5,0
0402 = smd 0.5 x 0.6: 1 -0.5,0; 2 0.5,0
0805 = smd 1.3 x 1.5: 1 -0.95,0; 2 0.95,0
SOD323(NXP)WAVE = smd 1.5 x 1.2: A 1.45,0; C -1.45,0
SMB(ON.SEMI) = smd 2.159 x 2.743: A 2.21,0; K -2.21,0
FIDUCIAL_40MIL = smd 1.016 x 1.016: P$1 0,0
SOT89-5(DIODES) = smd 0.68 x 1.5: 1 -1.5,-1.8; 3 1.5,-1.8; 4 1.5,1.8; 5 -1.5,1.8 | smd 0.76 x 1.5: 2 0,-1.8 | smd 1.93 x 3.35: THERMAL 0,0.625
UDFN8,2X3(ON-SEMI) = smd 0.3 x 0.68: 1 0.75,1.36; 2 0.25,1.36; 3 -0.25,1.36; 4 -0.75,1.36; 5 -0.75,-1.36; 6 -0.25,-1.36; 7 0.25,-1.36; 8 0.75,-1.36 | smd 1.56 x 1.45: P$1 0,0
SOT23-5(FAIRCHILD) = smd 0.7 x 1: 1 -0.95,-1.2; 2 0,-1.2; 3 0.95,-1.2; 4 0.95,1.2; 5 -0.95,1.2
JUMPER-(X2) = drill 0.889 pad 1.524: 1 -1.27,0; 2 1.27,0
NRS(TAIYO.YUDEN) = smd 1.5 x 4: 1 -1.8,0; 2 1.8,0
R0603 = smd 1 x 1.1: 1 -0.85,0; 2 0.85,0
SOLDER.JOINT(0402) = smd 0.55 x 0.6: 1 -0.475,0; 2 0.475,0
TESTPAD/W_HOLE_1X1 = drill 0.813 pad 1.626: P$1 0,0
KISD04-40_T1_E = smd 0.295 x 1.2: 1 9.75,3; 2 9.25,3; 3 8.75,3; 4 8.25,3; 5 7.75,3; 6 7.25,3; 7 6.75,3; 8 6.25,3; 9 5.75,3; 10 5.25,3; 11 4.75,3; 12 4.25,3; 13 3.75,3; 14 3.25,3; 15 2.75,3; 16 2.25,3; 17 1.75,3; 18 1.25,3; 19 0.75,3; 20 0.25,3; 21 -0.25,3; 22 -0.75,3; 23 -1.25,3; 24 -1.75,3; 25 -2.25,3; 26 -2.75,3; 27 -3.25,3; 28 -3.75,3; 29 -4.25,3; 30 -4.75,3; 31 -5.25,3; 32 -5.75,3; 33 -6.25,3; 34 -6.75,3; 35 -7.25,3; 36 -7.75,3; 37 -8.25,3; 38 -8.75,3; 39 -9.25,3; 40 -9.75,3 | smd 1.8 x 2: G1 -11.4,-0.15; G2 11.4,-0.15
10-PIN-(0.5MM-PITCH)-FPC-CONNECTOR = smd 0.3 x 1.25: 1 -2.25,-2.325; 2 -1.75,-2.325; 3 -1.25,-2.325; 4 -0.75,-2.325; 5 -0.25,-2.325; 6 0.25,-2.325; 7 0.75,-2.325; 8 1.25,-2.325; 9 1.75,-2.325; 10 2.25,-2.325 | smd 2 x 3: M1 -3.79,0; M2 3.79,0

### Placement (x,y rotation side)
BB.DISPLAY.CAPE-(BEAGLEBONE)  100.33,118.11 270 top
BB.DISPLAY.CAPE-(CAPE)  163.83,118.11 270 top
C1  26.54,94.74 270 bottom
C2  32,105.92 0 bottom
C3  40.01,82.42 90 bottom
C4  53.47,80.14 90 bottom
C5  40.64,90.3 0 bottom
C6  42.29,101.47 270 bottom
C7  59.69,114.17 0 bottom
C8  41.15,80.26 180 bottom
C9  173.99,76.96 180 bottom
D1  32,103.38 0 bottom
D2  44.7,101.47 270 bottom
D3  38.35,101.47 270 bottom
FUD1  3.81,111.12 0 bottom
FUD2  3.81,10.79 0 bottom
FUD3  198.5,9.65 270 bottom
IC1  38.86,94.36 0 bottom
IC2  59.69,116.08 270 bottom
IC13  32,99.82 270 bottom
JMP1  82.42,116.08 180 bottom
L1  26.54,99.82 90 bottom
L2  44.7,94.36 90 bottom
R1  37.08,90.3 180 bottom
R2  35.18,94.36 270 bottom
R3  53.72,116.84 270 bottom
R4  55.12,116.84 270 bottom
R5  56.39,116.84 270 bottom
R6  62.23,114.17 0 bottom
R7  83.19,89.66 90 bottom
R8  69.22,89.66 90 bottom
SJ1  54.36,114.3 0 bottom
SJ2  54.36,113.03 0 bottom
TP1  196.85,60.96 0 bottom
X2  48.26,74.8 0 bottom
X3  172.47,72.9 180 bottom

### Tracks (layer width: path | path; a pad name or v marks a point on that pad's centre or on a via)
+5V  (via drill 0.76 pad 0.18)
  Top 1.524: v24.77,96.14 24.77,91.82 29.46,87.12 41.53,87.12 v44.7,90.3 59.82,105.41 v75.44,105.41 | v76.96,105.41 v187.2,105.41
  other vias: 188.72,105.41
  pour Bottom: 24.51,95.38 28.07,95.38 29.59,96.9 29.59,99.44 29.97,99.82 31.5,99.82 31.75,100.08 31.75,101.47 31.5,101.73 30.1,101.73 29.59,101.22 29.59,100.46 28.7,99.57 24.13,99.57 23.62,99.06 23.62,96.27
  pour Bottom: 40.26,93.6 40.26,91.44 40.51,91.19 41.15,91.19 41.4,90.93 41.4,89.41 41.66,89.15 47.37,89.15 47.75,89.53 47.75,93.22 47.24,93.73 40.39,93.73
  pour Bottom: 183.64,105.41 183.64,106.05 184.02,106.43 191.9,106.43 192.28,106.05 192.28,104.78 191.9,104.39 184.02,104.39 183.64,104.78
  pour Bottom: 71.88,105.41 71.88,106.05 72.26,106.43 80.14,106.43 80.52,106.05 80.52,104.78 80.14,104.39 72.26,104.39 71.88,104.78
  pour Top: 71.88,104.78 71.88,106.05 72.26,106.43 80.14,106.43 80.52,106.05 80.52,104.78 80.14,104.39 72.26,104.39
  pour Top: 183.64,104.78 183.64,106.05 184.02,106.43 191.9,106.43 192.28,106.05 192.28,104.78 191.9,104.39 184.02,104.39
A0
  Bottom 0.152: IC2.1 54.73,115.33 R3.2 53.21,115.83 53.21,114.97 SJ1.2
A1
  Bottom 0.152: IC2.2 55.63,115.83 R4.2 54.62,116.84 53.21,116.84 52.74,116.36 52.74,114.17 SJ2.2
A2
  Bottom 0.152: IC2.3 56.4,116.33 R5.2
BL+
  pour Bottom: 24.13,100.08 28.45,100.08 29.08,100.71 29.08,101.47 29.84,102.23 31.88,102.23 32.26,101.85 32.26,100.71 32.38,100.58 34.16,100.58 34.42,100.84 34.42,101.35 34.16,101.6 32.89,101.6 31.75,102.74 31.75,104.39 31.5,104.65 24.13,104.65 23.62,104.14 23.62,100.58
CAP.TOUCH.IRQ
  Bottom 0.203: BB.DISPLAY.CAPE-(BEAGLEBONE).B9.30 80.39,77.47 81.66,76.2 162.31,76.2 167.64,70.87 171.96,70.87 | 172.21,70.87 172.47,70.87 | 172.47,70.87 177.29,70.87 183.9,77.47 BB.DISPLAY.CAPE-(CAPE).B9.30 | X3.5 172.22,71.12 | 172.22,71.12 172.47,70.87 | 172.22,71.12 172.21,71.12 | 172.21,71.12 171.96,70.87 | 171.96,70.87 172.21,70.87 | 172.21,70.87 172.21,71.12
GND  (via drill 0.41, 0.51, 0.76 pad 0.18)
  Bottom 0.203: BB.DISPLAY.CAPE-(BEAGLEBONE).B9.43 74.8,59.69 76.45,58.04 187.71,58.04 189.36,59.69 BB.DISPLAY.CAPE-(CAPE).B9.43 | BB.DISPLAY.CAPE-(BEAGLEBONE).B9.45 74.8,57.15 76.45,55.5 187.71,55.5 189.36,57.15 BB.DISPLAY.CAPE-(CAPE).B9.45 | BB.DISPLAY.CAPE-(BEAGLEBONE).B9.44 80.39,59.69 81.66,58.42 182.5,58.42 183.77,59.69 BB.DISPLAY.CAPE-(CAPE).B9.44 | BB.DISPLAY.CAPE-(BEAGLEBONE).B9.46 80.39,57.15 81.66,55.88 182.5,55.88 183.77,57.15 BB.DISPLAY.CAPE-(CAPE).B9.46
  Bottom 0.381: C1.2 v26.54,92.71 | IC13.2 v34.29,99.82 | C2.2 v29.72,105.92 | IC1.THERMAL IC1.2
  Bottom 0.61: C6.2 40.88,100.47 v40.64,100.71
  other vias: 38.86,89.03 59.18,108.58
  pour Bottom: 38.86,93.09 39.24,92.71 39.62,92.71 39.62,91.31 40.01,90.93 40.01,89.28 39.37,88.65 34.92,88.65 33.91,89.66 33.91,93.22 34.29,93.6 35.43,93.6 35.43,91.69 35.18,91.44 35.18,89.53 35.69,89.03 37.47,89.03 37.72,89.28 37.72,90.93 38.1,91.31 38.1,92.71 38.48,92.71
  pour Bottom (rank 2): 201.29,122.56 201.29,46.35 55.88,46.35 38.1,64.14 38.1,76.83 40.01,78.74 40.01,83.57 42.29,85.85 48.01,85.85 51.44,89.28 51.44,122.56
  pour Top: 59.82,108.58 59.82,108.33 59.44,107.95 40.13,88.65 38.48,88.65 30.1,88.65 26.16,92.58 26.16,102.87 29.46,106.17 32.51,109.22 59.18,109.22 59.44,109.22 59.82,108.84
I2C.SCL  (via drill 0.38 pad 0.18)
  Top 0.203: v171.32,76.71 172.21,77.6 172.97,77.6 183.13,87.76 v183.13,88.52
  Bottom 0.203: BB.DISPLAY.CAPE-(CAPE).B9.19 189.23,90.17 187.58,88.52 v183.13,88.52 76.45,88.52 74.8,90.17 BB.DISPLAY.CAPE-(BEAGLEBONE).B9.19 72.01,90.17 | X3.3 171.22,76.6 v171.32,76.71 | 72.01,90.17 71.88,90.04 | 71.88,90.04 71,89.16 R8.1 | 72.01,90.17 71.88,90.3 | 71.88,90.3 69.34,92.84 69.34,109.35 62.36,116.33 IC2.6 | 71.88,90.04 71.88,90.3
I2C.SDA  (via drill 0.38 pad 0.18)
  Top 0.203: v183.13,89.53 182.37,88.77 182.37,87.63 172.72,77.98 171.58,77.98 v170.31,76.71
  Bottom 0.203: BB.DISPLAY.CAPE-(CAPE).B9.20 183.77,90.17 v183.13,89.53 182.5,88.9 84.08,88.9 83.82,89.16 R7.1 82.55,89.16 82.29,88.9 81.66,88.9 80.39,90.17 BB.DISPLAY.CAPE-(BEAGLEBONE).B9.20 76.07,90.17 74.8,91.44 72.01,91.44 69.72,93.73 69.72,109.47 62.37,116.83 IC2.5 | X3.2 170.72,76.3 v170.31,76.71
LCD.B3  (via drill 0.38 pad 0.18)
  Top 0.203: v52.32,56.77 53.59,58.04 123.06,58.04 v123.95,57.15
  Bottom 0.203: BB.DISPLAY.CAPE-(BEAGLEBONE).B8.45 v123.95,57.15 124.84,56.26 140.21,56.26 141.1,57.15 BB.DISPLAY.CAPE-(CAPE).B8.45 | X2.24 50.01,59.08 v52.32,56.77
LCD.B4  (via drill 0.38 pad 0.18)
  Top 0.203: v52.32,57.78 52.96,58.42 123.7,58.42 v124.97,57.15
  Bottom 0.203: BB.DISPLAY.CAPE-(CAPE).B8.46 BB.DISPLAY.CAPE-(BEAGLEBONE).B8.46 v124.97,57.15 | X2.25 50.51,59.6 v52.32,57.78
LCD.B5  (via drill 0.38 pad 0.18)
  Top 0.203: v52.32,58.8 123.06,58.8 v123.95,59.69
  Bottom 0.203: BB.DISPLAY.CAPE-(BEAGLEBONE).B8.43 v123.95,59.69 124.84,58.8 140.21,58.8 141.1,59.69 BB.DISPLAY.CAPE-(CAPE).B8.43 | X2.26 51.01,60.12 v52.32,58.8
LCD.B6  (via drill 0.38 pad 0.18)
  Top 0.203: v52.32,59.82 52.96,59.18 122.43,59.18 123.57,60.33 124.33,60.33 v124.97,59.69
  Bottom 0.203: BB.DISPLAY.CAPE-(CAPE).B8.44 BB.DISPLAY.CAPE-(BEAGLEBONE).B8.44 v124.97,59.69 | X2.27 51.51,60.63 v52.32,59.82
LCD.B7  (via drill 0.38 pad 0.18)
  Top 0.203: v52.32,60.83 53.59,59.56 121.28,59.56 v123.95,62.23
  Bottom 0.203: BB.DISPLAY.CAPE-(BEAGLEBONE).B8.41 v123.95,62.23 124.84,61.34 140.21,61.34 141.1,62.23 BB.DISPLAY.CAPE-(CAPE).B8.41 | X2.28 52.01,61.15 v52.32,60.83
LCD.BACKLIGHT  (via drill 0.38 pad 0.18, 0.41)
  Top 0.254: v71.12,107.95 60.45,107.95 45.06,92.56 v36.32,92.56 31.47,92.56 v31.24,92.33
  Bottom 0.203: BB.DISPLAY.CAPE-(BEAGLEBONE).B9.14 80.39,97.79 81.66,96.52 182.5,96.52 183.77,97.79 BB.DISPLAY.CAPE-(CAPE).B9.14
  Bottom 0.254: R1.1 36.23,92.47 v36.32,92.56 IC1.3 | IC13.4 30.8,92.77 v31.24,92.33 | BB.DISPLAY.CAPE-(BEAGLEBONE).B9.14 76.71,97.79 75.44,99.06 72.64,99.06 71.12,100.58 v71.12,107.95
LCD.CLK  (via drill 0.38 pad 0.18)
  Top 0.203: v124.97,80.01 124.97,79.38 117.09,71.5 56.9,71.5 v55.24,69.85
  Bottom 0.203: BB.DISPLAY.CAPE-(CAPE).B8.28 BB.DISPLAY.CAPE-(BEAGLEBONE).B8.28 v124.97,80.01 | X2.30 53.01,72.08 v55.24,69.85
LCD.DEN  (via drill 0.38 pad 0.18)
  Top 0.203: v55.24,67.82 58.17,70.74 117.86,70.74 123.95,76.83 124.33,76.83 v124.97,77.47
  Bottom 0.203: BB.DISPLAY.CAPE-(CAPE).B8.30 BB.DISPLAY.CAPE-(BEAGLEBONE).B8.30 v124.97,77.47 | X2.34 55.01,73.13 56.26,71.88 56.26,68.83 v55.24,67.82
LCD.G2  (via drill 0.38 pad 0.18)
  Top 0.203: v48.26,59.94 49.86,61.54 122.25,61.54 123.57,62.87 124.33,62.87 v124.97,62.23
  Bottom 0.203: BB.DISPLAY.CAPE-(CAPE).B8.42 BB.DISPLAY.CAPE-(BEAGLEBONE).B8.42 v124.97,62.23 | X2.15 45.51,62.69 v48.26,59.94
LCD.G3  (via drill 0.38 pad 0.18)
  Top 0.203: v48.26,60.96 49.23,61.92 121.11,61.92 v123.95,64.77
  Bottom 0.203: BB.DISPLAY.CAPE-(CAPE).B8.39 141.1,64.77 140.21,63.88 124.84,63.88 v123.95,64.77 BB.DISPLAY.CAPE-(BEAGLEBONE).B8.39 | X2.16 46.01,63.21 v48.26,60.96
LCD.G4  (via drill 0.38 pad 0.18)
  Top 0.203: v48.26,61.98 48.59,62.31 120.47,62.31 123.57,65.41 124.33,65.41 v124.97,64.77
  Bottom 0.203: BB.DISPLAY.CAPE-(CAPE).B8.40 BB.DISPLAY.CAPE-(BEAGLEBONE).B8.40 v124.97,64.77 | X2.17 46.51,63.73 v48.26,61.98
LCD.G5  (via drill 0.38 pad 0.18)
  Top 0.203: v48.26,62.99 48.59,62.66 119.3,62.66 v123.95,67.31
  Bottom 0.203: BB.DISPLAY.CAPE-(CAPE).B8.37 141.1,67.31 140.21,66.42 124.84,66.42 v123.95,67.31 BB.DISPLAY.CAPE-(BEAGLEBONE).B8.37 | X2.18 47.01,64.24 v48.26,62.99
LCD.G6  (via drill 0.38 pad 0.18)
  Top 0.203: v48.26,64.01 49.23,63.04 118.67,63.04 123.57,67.94 124.33,67.94 v124.97,67.31
  Bottom 0.203: BB.DISPLAY.CAPE-(CAPE).B8.38 BB.DISPLAY.CAPE-(BEAGLEBONE).B8.38 v124.97,67.31 | X2.19 47.51,64.76 v48.26,64.01
LCD.G7  (via drill 0.38 pad 0.18)
  Top 0.203: v48.26,65.02 49.86,63.42 118.42,63.42 123.32,68.33 124.33,68.33 125.09,69.09 v125.09,69.85
  Bottom 0.203: BB.DISPLAY.CAPE-(CAPE).B8.36 BB.DISPLAY.CAPE-(BEAGLEBONE).B8.36 v125.09,69.85 | X2.20 48.01,65.27 v48.26,65.02
LCD.HSYNC  (via drill 0.38 pad 0.18)
  Top 0.203: v55.24,68.83 57.53,71.12 117.6,71.12 v123.95,77.47
  Bottom 0.203: BB.DISPLAY.CAPE-(CAPE).B8.29 141.1,77.47 140.21,76.58 124.84,76.58 v123.95,77.47 BB.DISPLAY.CAPE-(BEAGLEBONE).B8.29 | X2.32 54.01,72.1 55.88,70.23 55.88,69.47 v55.24,68.83
LCD.R3  (via drill 0.38 pad 0.18)
  Top 0.203: v44.32,64.39 45.59,65.66 120.02,65.66 123.06,68.71 123.7,68.71 124.46,69.47 124.46,70.23 124.97,70.74 v124.97,72.39
  Bottom 0.203: BB.DISPLAY.CAPE-(CAPE).B8.34 BB.DISPLAY.CAPE-(BEAGLEBONE).B8.34 v124.97,72.39 | X2.8 42.01,66.7 v44.32,64.39
LCD.R4  (via drill 0.38 pad 0.18)
  Top 0.203: v44.32,65.41 44.96,66.04 119.76,66.04 123.57,69.85 v123.83,69.85
  Bottom 0.203: BB.DISPLAY.CAPE-(CAPE).B8.35 141.1,69.85 140.21,68.96 124.71,68.96 v123.83,69.85 BB.DISPLAY.CAPE-(BEAGLEBONE).B8.35 | X2.9 42.51,67.22 v44.32,65.41
LCD.R5  (via drill 0.38 pad 0.18)
  Top 0.203: v44.32,66.42 119.51,66.42 123.95,70.87 v123.95,72.39
  Bottom 0.203: BB.DISPLAY.CAPE-(CAPE).B8.33 141.1,72.39 140.21,71.5 124.84,71.5 v123.95,72.39 BB.DISPLAY.CAPE-(BEAGLEBONE).B8.33 | X2.10 43.01,67.73 v44.32,66.42
LCD.R6  (via drill 0.38 pad 0.18)
  Top 0.203: v44.32,67.44 44.96,66.8 115.82,66.8 v123.95,74.93
  Bottom 0.203: BB.DISPLAY.CAPE-(CAPE).B8.31 141.1,74.93 140.21,74.04 124.84,74.04 v123.95,74.93 BB.DISPLAY.CAPE-(BEAGLEBONE).B8.31 | X2.11 43.51,68.25 v44.32,67.44
LCD.R7  (via drill 0.38 pad 0.18)
  Top 0.203: v44.32,68.45 45.59,67.18 115.19,67.18 123.57,75.56 124.33,75.56 v124.97,74.93
  Bottom 0.203: X2.12 44.01,68.77 v44.32,68.45 | BB.DISPLAY.CAPE-(CAPE).B8.32 BB.DISPLAY.CAPE-(BEAGLEBONE).B8.32 v124.97,74.93
LCD.VSYNC  (via drill 0.38 pad 0.18)
  Top 0.203: v123.95,80.01 123.95,78.99 116.84,71.88 v55.24,71.88
  Bottom 0.203: BB.DISPLAY.CAPE-(CAPE).B8.27 141.1,80.01 140.21,79.12 124.84,79.12 v123.95,80.01 BB.DISPLAY.CAPE-(BEAGLEBONE).B8.27 | X2.33 54.51,72.62 v55.24,71.88
LED+
  Bottom 0.254: X2.2 39.01,78.97
  Bottom 0.381: 39.01,78.97 39.01,84.22 41.78,87 47.24,87 49.78,89.53 49.78,101.47 48.33,102.92 D2.C
  pour Bottom: 45.72,101.73 43.69,101.73 43.31,102.11 33.66,102.11 33.15,102.62 33.15,104.39 32.64,104.9 32.64,107.57 33.15,108.08 38.73,108.08 41.02,105.79 44.07,105.79 46.86,103 46.86,102.87
LED-
  pour Bottom: 36.7,100.84 38.35,100.84 38.61,100.58 38.61,97.41 38.48,97.28 37.72,97.28 37.47,97.03 37.47,94.87 37.21,94.61 36.58,94.61 36.07,95.12 33.91,95.12 33.15,94.36 33.15,88.77 37.59,84.33 37.59,78.36 38.1,77.85 38.61,77.85 38.61,76.58 37.97,76.58 37.47,77.09 37.47,84.2 32,89.66 32,98.81 32.26,99.06 34.92,99.06
P8.3
  Bottom 0.203: BB.DISPLAY.CAPE-(BEAGLEBONE).B8.3 123.06,110.49 123.95,109.6 140.21,109.6 141.1,110.49 BB.DISPLAY.CAPE-(CAPE).B8.3
P8.4
  Bottom 0.203: BB.DISPLAY.CAPE-(CAPE).B8.4 BB.DISPLAY.CAPE-(BEAGLEBONE).B8.4
P8.5
  Bottom 0.203: BB.DISPLAY.CAPE-(BEAGLEBONE).B8.5 123.06,107.95 123.95,107.06 140.21,107.06 141.1,107.95 BB.DISPLAY.CAPE-(CAPE).B8.5
P8.6
  Bottom 0.203: BB.DISPLAY.CAPE-(CAPE).B8.6 BB.DISPLAY.CAPE-(BEAGLEBONE).B8.6
P8.7
  Bottom 0.203: BB.DISPLAY.CAPE-(BEAGLEBONE).B8.7 123.06,105.41 123.95,104.52 140.21,104.52 141.1,105.41 BB.DISPLAY.CAPE-(CAPE).B8.7
P8.8
  Bottom 0.203: BB.DISPLAY.CAPE-(BEAGLEBONE).B8.8 BB.DISPLAY.CAPE-(CAPE).B8.8
P8.9
  Bottom 0.203: BB.DISPLAY.CAPE-(BEAGLEBONE).B8.9 123.06,102.87 123.95,101.98 140.21,101.98 141.1,102.87 BB.DISPLAY.CAPE-(CAPE).B8.9
P8.10
  Bottom 0.203: BB.DISPLAY.CAPE-(CAPE).B8.10 BB.DISPLAY.CAPE-(BEAGLEBONE).B8.10
P8.11
  Bottom 0.203: BB.DISPLAY.CAPE-(BEAGLEBONE).B8.11 123.06,100.33 123.95,99.44 140.21,99.44 141.1,100.33 BB.DISPLAY.CAPE-(CAPE).B8.11
P8.12
  Bottom 0.203: BB.DISPLAY.CAPE-(CAPE).B8.12 BB.DISPLAY.CAPE-(BEAGLEBONE).B8.12
P8.13
  Bottom 0.203: BB.DISPLAY.CAPE-(BEAGLEBONE).B8.13 123.06,97.79 123.95,96.9 140.21,96.9 141.1,97.79 BB.DISPLAY.CAPE-(CAPE).B8.13
P8.14
  Bottom 0.203: BB.DISPLAY.CAPE-(CAPE).B8.14 BB.DISPLAY.CAPE-(BEAGLEBONE).B8.14
P8.15
  Bottom 0.203: BB.DISPLAY.CAPE-(BEAGLEBONE).B8.15 123.06,95.25 123.95,94.36 140.21,94.36 141.1,95.25 BB.DISPLAY.CAPE-(CAPE).B8.15
P8.16
  Bottom 0.203: BB.DISPLAY.CAPE-(CAPE).B8.16 BB.DISPLAY.CAPE-(BEAGLEBONE).B8.16
P8.17
  Bottom 0.203: BB.DISPLAY.CAPE-(BEAGLEBONE).B8.17 123.06,92.71 123.95,91.82 140.21,91.82 141.1,92.71 BB.DISPLAY.CAPE-(CAPE).B8.17
P8.18
  Bottom 0.203: BB.DISPLAY.CAPE-(CAPE).B8.18 BB.DISPLAY.CAPE-(BEAGLEBONE).B8.18
P8.19
  Bottom 0.203: BB.DISPLAY.CAPE-(BEAGLEBONE).B8.19 123.06,90.17 123.95,89.28 140.21,89.28 141.1,90.17 BB.DISPLAY.CAPE-(CAPE).B8.19
P8.20
  Bottom 0.203: BB.DISPLAY.CAPE-(BEAGLEBONE).B8.20 BB.DISPLAY.CAPE-(CAPE).B8.20
P8.21
  Bottom 0.203: BB.DISPLAY.CAPE-(BEAGLEBONE).B8.21 123.06,87.63 123.95,86.74 140.21,86.74 141.1,87.63 BB.DISPLAY.CAPE-(CAPE).B8.21
P8.22
  Bottom 0.203: BB.DISPLAY.CAPE-(BEAGLEBONE).B8.22 BB.DISPLAY.CAPE-(CAPE).B8.22
P8.23
  Bottom 0.203: BB.DISPLAY.CAPE-(BEAGLEBONE).B8.23 123.06,85.09 123.95,84.2 140.21,84.2 141.1,85.09 BB.DISPLAY.CAPE-(CAPE).B8.23
P8.24
  Bottom 0.203: BB.DISPLAY.CAPE-(BEAGLEBONE).B8.24 BB.DISPLAY.CAPE-(CAPE).B8.24
P8.25
  Bottom 0.203: BB.DISPLAY.CAPE-(BEAGLEBONE).B8.25 123.06,82.55 123.95,81.66 140.21,81.66 141.1,82.55 BB.DISPLAY.CAPE-(CAPE).B8.25
P8.26
  Bottom 0.203: BB.DISPLAY.CAPE-(BEAGLEBONE).B8.26 BB.DISPLAY.CAPE-(CAPE).B8.26
P9.9
  Bottom 0.203: BB.DISPLAY.CAPE-(BEAGLEBONE).B9.9 74.8,102.87 76.45,101.22 187.71,101.22 189.36,102.87 BB.DISPLAY.CAPE-(CAPE).B9.9
P9.10
  Bottom 0.203: BB.DISPLAY.CAPE-(BEAGLEBONE).B9.10 80.39,102.87 81.66,101.6 182.5,101.6 183.77,102.87 BB.DISPLAY.CAPE-(CAPE).B9.10
P9.11
  Bottom 0.203: BB.DISPLAY.CAPE-(BEAGLEBONE).B9.11 74.8,100.33 76.45,98.68 187.71,98.68 189.36,100.33 BB.DISPLAY.CAPE-(CAPE).B9.11
P9.12
  Bottom 0.203: BB.DISPLAY.CAPE-(BEAGLEBONE).B9.12 80.39,100.33 81.66,99.06 182.5,99.06 183.77,100.33 BB.DISPLAY.CAPE-(CAPE).B9.12
P9.13
  Bottom 0.203: BB.DISPLAY.CAPE-(BEAGLEBONE).B9.13 74.8,97.79 76.45,96.14 187.71,96.14 189.36,97.79 BB.DISPLAY.CAPE-(CAPE).B9.13
P9.15
  Bottom 0.203: BB.DISPLAY.CAPE-(BEAGLEBONE).B9.15 74.8,95.25 76.45,93.6 187.71,93.6 189.36,95.25 BB.DISPLAY.CAPE-(CAPE).B9.15
P9.16
  Bottom 0.203: BB.DISPLAY.CAPE-(BEAGLEBONE).B9.16 80.39,95.25 81.66,93.98 182.5,93.98 183.77,95.25 BB.DISPLAY.CAPE-(CAPE).B9.16
P9.17
  Bottom 0.203: BB.DISPLAY.CAPE-(BEAGLEBONE).B9.17 74.8,92.71 76.45,91.06 187.71,91.06 189.36,92.71 BB.DISPLAY.CAPE-(CAPE).B9.17
P9.18
  Bottom 0.203: BB.DISPLAY.CAPE-(BEAGLEBONE).B9.18 80.39,92.71 81.66,91.44 182.5,91.44 183.77,92.71 BB.DISPLAY.CAPE-(CAPE).B9.18
P9.21
  Bottom 0.203: BB.DISPLAY.CAPE-(BEAGLEBONE).B9.21 74.8,87.63 76.45,85.98 187.58,85.98 189.23,87.63 BB.DISPLAY.CAPE-(CAPE).B9.21
P9.22
  Bottom 0.203: BB.DISPLAY.CAPE-(BEAGLEBONE).B9.22 80.39,87.63 81.66,86.36 182.5,86.36 183.77,87.63 BB.DISPLAY.CAPE-(CAPE).B9.22
P9.23
  Bottom 0.203: BB.DISPLAY.CAPE-(BEAGLEBONE).B9.23 74.8,85.09 76.45,83.44 187.71,83.44 189.36,85.09 BB.DISPLAY.CAPE-(CAPE).B9.23
P9.24
  Bottom 0.203: BB.DISPLAY.CAPE-(BEAGLEBONE).B9.24 80.39,85.09 81.66,83.82 182.5,83.82 183.77,85.09 BB.DISPLAY.CAPE-(CAPE).B9.24
P9.25
  Bottom 0.203: BB.DISPLAY.CAPE-(BEAGLEBONE).B9.25 74.8,82.55 76.45,80.9 187.71,80.9 189.36,82.55 BB.DISPLAY.CAPE-(CAPE).B9.25
P9.26
  Bottom 0.203: BB.DISPLAY.CAPE-(BEAGLEBONE).B9.26 80.39,82.55 81.66,81.28 182.5,81.28 183.77,82.55 BB.DISPLAY.CAPE-(CAPE).B9.26
P9.27
  Bottom 0.203: BB.DISPLAY.CAPE-(BEAGLEBONE).B9.27 74.8,80.01 76.45,78.36 143.89,78.36 144.65,79.12 186.44,79.12 187.32,80.01 BB.DISPLAY.CAPE-(CAPE).B9.27
P9.28
  Bottom 0.203: BB.DISPLAY.CAPE-(BEAGLEBONE).B9.28 80.39,80.01 81.66,78.74 143.64,78.74 144.91,80.01 BB.DISPLAY.CAPE-(CAPE).B9.28
P9.29
  Bottom 0.203: BB.DISPLAY.CAPE-(BEAGLEBONE).B9.29 74.8,77.47 76.45,75.82 162.18,75.82 167.51,70.48 177.42,70.48 182.75,75.82 187.71,75.82 189.36,77.47 BB.DISPLAY.CAPE-(CAPE).B9.29
P9.31
  Bottom 0.203: BB.DISPLAY.CAPE-(BEAGLEBONE).B9.31 74.8,74.93 76.45,73.28 163.7,73.28 167.26,69.72 177.67,69.72 181.23,73.28 187.71,73.28 189.36,74.93 BB.DISPLAY.CAPE-(CAPE).B9.31
P9.32
  Bottom 0.203: BB.DISPLAY.CAPE-(BEAGLEBONE).B9.32 80.39,74.93 81.66,73.66 163.83,73.66 167.39,70.1 177.55,70.1 182.37,74.93 BB.DISPLAY.CAPE-(CAPE).B9.32
P9.33
  Bottom 0.203: BB.DISPLAY.CAPE-(BEAGLEBONE).B9.33 74.8,72.39 76.45,70.74 165.23,70.74 167,68.96 177.93,68.96 179.71,70.74 187.71,70.74 189.36,72.39 BB.DISPLAY.CAPE-(CAPE).B9.33
P9.34
  Bottom 0.203: BB.DISPLAY.CAPE-(BEAGLEBONE).B9.34 80.39,72.39 81.66,71.12 165.35,71.12 167.13,69.34 177.8,69.34 180.85,72.39 BB.DISPLAY.CAPE-(CAPE).B9.34
P9.35
  Bottom 0.203: BB.DISPLAY.CAPE-(BEAGLEBONE).B9.35 74.8,69.85 76.45,68.2 187.71,68.2 189.36,69.85 BB.DISPLAY.CAPE-(CAPE).B9.35
P9.36
  Bottom 0.203: BB.DISPLAY.CAPE-(BEAGLEBONE).B9.36 80.39,69.85 81.66,68.58 178.05,68.58 179.32,69.85 BB.DISPLAY.CAPE-(CAPE).B9.36
P9.37
  Bottom 0.203: BB.DISPLAY.CAPE-(BEAGLEBONE).B9.37 74.8,67.31 76.45,65.66 187.71,65.66 189.36,67.31 BB.DISPLAY.CAPE-(CAPE).B9.37
P9.38
  Bottom 0.203: BB.DISPLAY.CAPE-(BEAGLEBONE).B9.38 80.39,67.31 81.66,66.04 182.5,66.04 183.77,67.31 BB.DISPLAY.CAPE-(CAPE).B9.38
P9.39
  Bottom 0.203: BB.DISPLAY.CAPE-(BEAGLEBONE).B9.39 74.8,64.77 76.45,63.12 187.71,63.12 189.36,64.77 BB.DISPLAY.CAPE-(CAPE).B9.39
P9.40
  Bottom 0.203: BB.DISPLAY.CAPE-(BEAGLEBONE).B9.40 80.39,64.77 81.66,63.5 182.5,63.5 183.77,64.77 BB.DISPLAY.CAPE-(CAPE).B9.40
P9.41
  Bottom 0.203: BB.DISPLAY.CAPE-(BEAGLEBONE).B9.41 74.8,62.23 76.45,60.58 187.71,60.58 189.36,62.23 BB.DISPLAY.CAPE-(CAPE).B9.41
P9.42
  Bottom 0.203: BB.DISPLAY.CAPE-(BEAGLEBONE).B9.42 80.39,62.23 81.66,60.96 182.5,60.96 183.77,62.23 BB.DISPLAY.CAPE-(CAPE).B9.42
PUMP
  pour Bottom: 47.24,95 40.39,95 40.26,95.12 40.26,97.28 41.15,98.17 43.18,98.17 43.69,98.68 43.69,100.2 45.72,100.2 45.72,99.44 46.23,98.93 47.37,98.93 47.75,98.55 47.75,95.5
RESET  (via drill 0.38 pad 0.18)
  Top 0.203: v171.45,73.91 184.4,60.96 TP1.P$1
  Bottom 0.203: X3.4 171.72,74.18 v171.45,73.91
VCC  (via drill 0.38 pad 0.18, 0.41, 0.76 pad 0.18)
  Top 0.203: v55.12,118.24 55.88,118.24 v60.96,113.16
  Top 0.508: v188.72,110.49 192.91,110.49 194.18,109.22 194.18,97.92 173.23,76.96 v172.59,76.96 | v84.33,89.66 81.28,92.71 v76.2,92.71 70.87,92.71 v69.22,91.06
  Top 1.524: v76.96,110.49 v187.2,110.49 | v75.44,110.49 v60.96,110.49 28.7,110.49 22.1,103.89 22.1,90.55 30.73,81.92 v40.89,81.92 50.29,81.92 v51.82,80.39
  Bottom 0.203: R7.2 83.69,89.66 v84.33,89.66 | R8.2 v69.22,91.06 | v60.96,110.49 v60.96,113.16 60.96,114.17 | 60.96,114.17 C7.1 | R6.2 60.96,114.17 | R4.1 v55.12,118.24 | R4.1 R5.1 | R3.1 R4.1 | X2.4 40.01,79 40.2,79.19 C8.1
  Bottom 0.254: C3.1 | X2.31 53.51,79.59 C4.1 52.57,79.64 v51.82,80.39 | C8.1 40.2,81.21 40.01,81.41 C3.1 | C3.1 v40.89,81.92
  Bottom 0.508: v76.2,92.71 74.93,93.98 71.5,93.98 70.23,95.25 70.23,108.84 71.88,110.49 v75.44,110.49
  pour Bottom: 173.1,75.18 173.1,76.2 172.47,76.2 172.09,76.58 172.09,77.34 172.72,77.98 173.86,77.98 173.86,75.18 173.61,75.18 173.61,75.44 173.35,75.44 173.35,75.18
  pour Bottom: 183.64,110.49 183.64,111.12 184.02,111.51 191.9,111.51 192.28,111.12 192.28,109.86 191.9,109.47 184.02,109.47 183.64,109.86
  pour Bottom: 71.88,109.86 71.12,109.86 70.1,108.84 70.1,109.35 72.26,111.51 80.14,111.51 80.52,111.12 80.52,109.86 80.14,109.47 72.26,109.47
  pour Top: 71.88,109.86 71.88,111.12 72.26,111.51 80.14,111.51 80.52,111.12 80.52,109.86 80.14,109.47 72.26,109.47
  pour Top: 183.64,109.86 183.64,111.12 184.02,111.51 193.29,111.51 194.31,110.49 194.31,109.09 193.29,110.11 192.53,110.11 191.9,109.47 184.02,109.47
  pour Bottom: 60.07,115.44 61.72,115.44 61.85,115.32 61.85,113.41 60.96,112.52 60.07,113.41
VDD.5V  (via drill 0.76 pad 0.18)
  Top 1.524: v76.96,107.95 v187.2,107.95
  other vias: 188.72,107.95 75.44,107.95
  pour Bottom: 183.64,107.95 183.64,108.58 184.02,108.97 191.9,108.97 192.28,108.58 192.28,107.31 191.9,106.93 184.02,106.93 183.64,107.31
  pour Bottom: 71.88,107.95 71.88,108.58 72.26,108.97 80.14,108.97 80.52,108.58 80.52,107.31 80.14,106.93 72.26,106.93 71.88,107.31
  pour Top: 71.88,107.31 71.88,108.58 72.26,108.97 80.14,108.97 80.52,108.58 80.52,107.31 80.14,106.93 72.26,106.93
  pour Top: 183.64,107.31 183.64,108.58 184.02,108.97 191.9,108.97 192.28,108.58 192.28,107.31 191.9,106.93 184.02,106.93
WP  (via drill 0.38 pad 0.18)
  Top 0.203: JMP1.1 80.52,115.44 71.88,115.44 69.6,113.16 v64.39,113.16
  Bottom 0.203: IC2.7 62.35,115.83 62.73,115.45 R6.1 64.01,114.17 64.39,113.79 v64.39,113.16

### Text on the board
tPlace: BeagleBone | Display | 7 | Cape | A1
bPlace: A0 | A1 | EEPROM / WP